# Altium project FIT_PM_Dual_Range_AFE.PrjPcb (part 1 of 8)
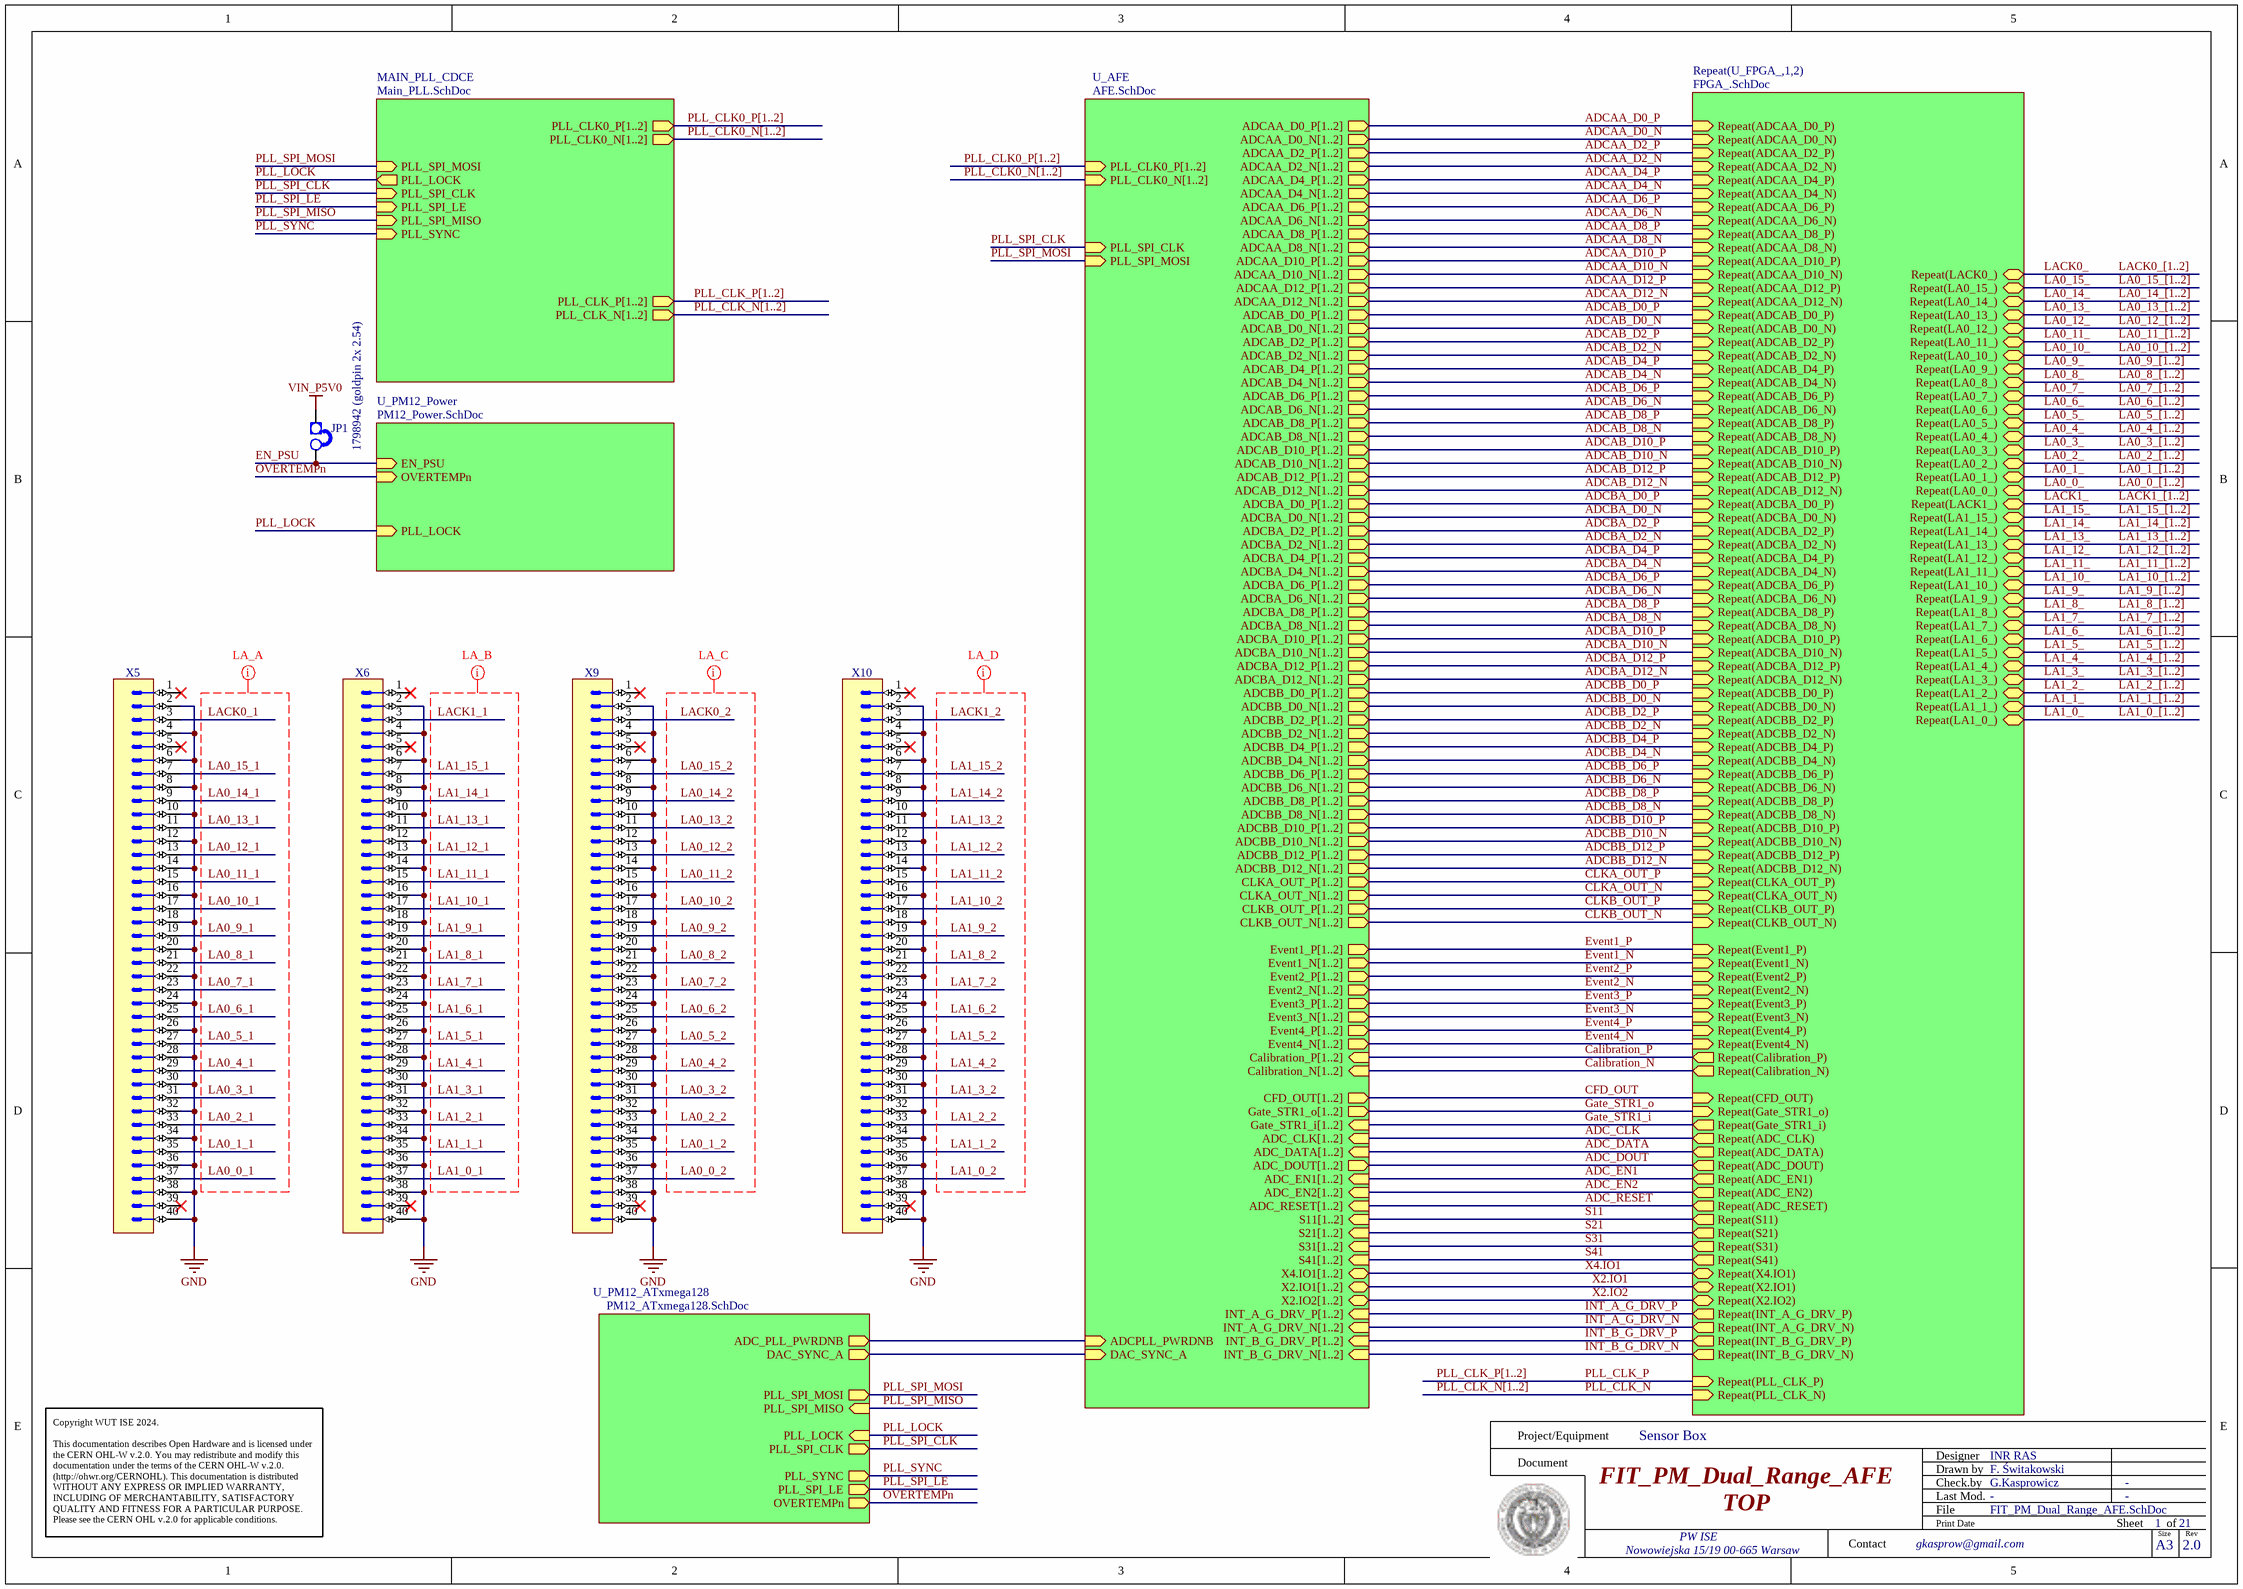
[diagram p0: FIT_PM_Dual_Range_AFE.SchDoc]
rev: 2.0
21 sheets, 892 parts. Net scope: hierarchical (ports join the sheet entries above them; power ports are global).
Board file: FIT_PM_Dual_Range_AFE.PcbDoc
Sheets:
  FIT_PM_Dual_Range_AFE.SchDoc
    MAIN_PLL_CDCE = Main_PLL.SchDoc
      U_ADCLK = ADCLK.SchDoc
    U_PM12_Power = PM12_Power.SchDoc
      U_PM12_LDO = PM12_LDO.SchDoc
      U_PM12_Supply_LED = PM12_Supply_LED.SchDoc
      U_PM12_P3V8 = PM12_P3V8.SchDoc
      U_PM12_P3V3 = PM12_P3V3.SchDoc
      U_PM12_N5V5 = PM12_N5V5.SchDoc
      U_PM12_P5V5 = PM12_P5V5.SchDoc
      U_PM12_P1V8 = PM12_P1V8.SchDoc
      U_SUP_VCCINT = SUP_VCCINT.SchDoc
    U_AFE = AFE.SchDoc
      INT1 = Integrators.SchDoc
      INT2 = Integrators.SchDoc
      QDC1 = DAC8554.SchDoc
      QDC2 = DAC8554.SchDoc
      ADC_PLL1 = ADC_PLL.SchDoc
      ADC_PLL2 = ADC_PLL.SchDoc
      Gate_Strobe1 = Gate_Strobe.SchDoc
      Gate_Strobe2 = Gate_Strobe.SchDoc
      U_ADCs1 = ADCs.SchDoc
      U_ADCs2 = ADCs.SchDoc
    U_PM12_ATxmega128 = PM12_ATxmega128.SchDoc
    U_FPGA_1 = FPGA_.SchDoc
      U_FPGA_MICS_SUP = FPGA_MICS_SUP.SchDoc
    U_FPGA_2 = FPGA_.SchDoc
      U_FPGA_MICS_SUP = FPGA_MICS_SUP.SchDoc

## Sheet FIT_PM_Dual_Range_AFE.SchDoc: FIT_PM_Dual_Range_AFE
size 420 x 297 mm; CheckedBy: G.Kasprowicz; Author: INR Moscow; CompanyName: WUT ISE; DrawnBy: F. Świtakowski; Organization: WUT ISE; Address1: PW ISE; Address2: Nowowiejska 15/19 00-665 Warsaw; Address3: gkasprow@gmail.com; DocumentNumber: 1; Revision: 2; SheetNumber: 1; SheetTotal: 21; ModifiedBy: -; CheckedDate: -; Title2: TOP; DivGrp: WUT ISE; Designer: INR RAS; ModifiedDate: -; ProjectName: Sensor Box

### Parts
JP1  1798942 (goldpin 2x 2.54)  [jump]
X5  (no value)  [CONNFLY_DS1013-40SSIB1-B-0]
X6  (no value)  [CONNFLY_DS1013-40SSIB1-B-0]
X9  (no value)  [CONNFLY_DS1013-40SSIB1-B-0]
X10  (no value)  [CONNFLY_DS1013-40SSIB1-B-0]

### Sub-sheets
MAIN_PLL_CDCE = Main_PLL.SchDoc: PLL_SPI_CLK (in), PLL_SYNC (in), PLL_LOCK (out), PLL_SPI_LE (in), PLL_SPI_MOSI (in), PLL_CLK0_P[1..2] (out), PLL_CLK0_N[1..2] (out), PLL_SPI_MISO (in), PLL_CLK_P[1..2] (out), PLL_CLK_N[1..2] (out)
Repeat(U_FPGA_,1,2) = FPGA_.SchDoc: Repeat(CLKB_OUT_P) (in), Repeat(CLKB_OUT_N) (in), Repeat(PLL_CLK_P) (in), Repeat(PLL_CLK_N) (in), Repeat(X4.IO1) (bidir), Repeat(X2.IO1) (bidir), Repeat(X2.IO2) (bidir), Repeat(ADCAA_D0_P) (in), Repeat(ADCAA_D0_N) (in), Repeat(ADCAA_D2_P) (in), Repeat(ADCAA_D2_N) (in), Repeat(ADCAA_D4_P) (in), Repeat(ADCAA_D4_N) (in), Repeat(ADCAA_D6_P) (in), Repeat(ADCAA_D6_N) (in), Repeat(ADCAA_D8_P) (in), Repeat(ADCAA_D8_N) (in), Repeat(ADCAA_D10_P) (in), Repeat(ADCAA_D10_N) (in), Repeat(ADCAA_D12_P) (in), Repeat(ADCAA_D12_N) (in), Repeat(CLKA_OUT_P) (in), Repeat(CLKA_OUT_N) (in), Repeat(ADCAB_D0_P) (in), Repeat(ADCAB_D0_N) (in), Repeat(ADCAB_D2_P) (in), Repeat(ADCAB_D2_N) (in), Repeat(ADCAB_D4_P) (in), Repeat(ADCAB_D4_N) (in), Repeat(ADCAB_D6_P) (in), Repeat(ADCAB_D6_N) (in), Repeat(ADCAB_D8_P) (in), Repeat(ADCAB_D8_N) (in), Repeat(ADCAB_D10_P) (in), Repeat(ADCAB_D10_N) (in), Repeat(ADCAB_D12_P) (in), Repeat(ADCAB_D12_N) (in), Repeat(ADCBA_D0_P) (in), Repeat(ADCBA_D0_N) (in), Repeat(ADCBA_D2_P) (in), Repeat(ADCBA_D2_N) (in), Repeat(ADCBA_D4_P) (in), Repeat(ADCBA_D4_N) (in), Repeat(ADCBA_D6_P) (in), Repeat(ADCBA_D6_N) (in), Repeat(ADCBA_D8_P) (in), Repeat(ADCBA_D8_N) (in), Repeat(ADCBA_D10_P) (in), Repeat(ADCBA_D10_N) (in), Repeat(ADCBA_D12_P) (in), Repeat(ADCBA_D12_N) (in), Repeat(ADCBB_D0_P) (in), Repeat(ADCBB_D0_N) (in), Repeat(ADCBB_D2_P) (in), Repeat(ADCBB_D2_N) (in), Repeat(ADCBB_D4_P) (in), Repeat(ADCBB_D4_N) (in), Repeat(ADCBB_D6_P) (in), Repeat(ADCBB_D6_N) (in), Repeat(ADCBB_D8_P) (in), Repeat(ADCBB_D8_N) (in), Repeat(ADCBB_D10_P) (in), Repeat(ADCBB_D10_N) (in), Repeat(ADCBB_D12_P) (in), Repeat(ADCBB_D12_N) (in), Repeat(Event1_P) (in), Repeat(Event1_N) (in), Repeat(CFD_OUT) (in), Repeat(Gate_STR1_o) (in), Repeat(Gate_STR1_i) (out), Repeat(ADC_CLK) (out), Repeat(ADC_DATA) (out), Repeat(ADC_DOUT) (out), Repeat(ADC_EN1) (out), Repeat(ADC_EN2) (out), Repeat(ADC_RESET) (out), Repeat(INT_A_G_DRV_P) (out), Repeat(INT_B_G_DRV_P) (out), Repeat(LACK0_) (bidir), Repeat(LA0_15_) (bidir), Repeat(LA0_14_) (bidir), Repeat(LA0_13_) (bidir), Repeat(LA0_12_) (bidir), Repeat(LA0_11_) (bidir), Repeat(LA0_10_) (bidir), Repeat(LA0_9_) (bidir), Repeat(LA0_8_) (bidir), Repeat(LA0_7_) (bidir), Repeat(LA0_6_) (bidir), Repeat(LA0_5_) (bidir), Repeat(LA0_4_) (bidir), Repeat(LA0_3_) (bidir), Repeat(LA0_2_) (bidir), Repeat(LA0_1_) (bidir), Repeat(LA0_0_) (bidir), Repeat(LACK1_) (bidir), Repeat(LA1_15_) (bidir), Repeat(LA1_14_) (bidir), Repeat(LA1_13_) (bidir), Repeat(LA1_12_) (bidir), Repeat(LA1_11_) (bidir), Repeat(LA1_10_) (bidir), Repeat(LA1_9_) (bidir), Repeat(LA1_8_) (bidir), Repeat(LA1_7_) (bidir), Repeat(LA1_6_) (bidir), Repeat(LA1_5_) (bidir), Repeat(LA1_4_) (bidir), Repeat(LA1_3_) (bidir), Repeat(LA1_2_) (bidir), Repeat(LA1_1_) (bidir), Repeat(LA1_0_) (bidir), Repeat(INT_A_G_DRV_N) (out), Repeat(INT_B_G_DRV_N) (out), Repeat(Event2_P) (in), Repeat(Event2_N) (in), Repeat(Event3_P) (in), Repeat(Event3_N) (in), Repeat(Event4_P) (in), Repeat(Event4_N) (in), Repeat(Calibration_P) (out), Repeat(Calibration_N) (out), Repeat(S11) (out), Repeat(S21) (out), Repeat(S31) (out), Repeat(S41) (out)
U_AFE = AFE.SchDoc: ADCPLL_PWRDNB (in), Event1_P[1..2] (out), PLL_CLK0_P[1..2] (in), PLL_CLK0_N[1..2] (in), ADCAA_D0_P[1..2] (out), ADCAA_D0_N[1..2] (out), ADCAA_D2_P[1..2] (out), ADCAA_D2_N[1..2] (out), ADCAA_D4_P[1..2] (out), ADCAA_D4_N[1..2] (out), ADCAA_D6_P[1..2] (out), ADCAA_D6_N[1..2] (out), ADCAA_D8_P[1..2] (out), ADCAA_D8_N[1..2] (out), ADCAA_D10_P[1..2] (out), ADCAA_D10_N[1..2] (out), ADCAA_D12_P[1..2] (out), ADCAA_D12_N[1..2] (out), ADCAB_D0_P[1..2] (out), ADCAB_D0_N[1..2] (out), ADCAB_D2_P[1..2] (out), ADCAB_D2_N[1..2] (out), ADCAB_D4_P[1..2] (out), ADCAB_D4_N[1..2] (out), ADCAB_D6_P[1..2] (out), ADCAB_D6_N[1..2] (out), ADCAB_D8_P[1..2] (out), ADCAB_D8_N[1..2] (out), ADCAB_D10_P[1..2] (out), ADCAB_D10_N[1..2] (out), ADCAB_D12_P[1..2] (out), ADCAB_D12_N[1..2] (out), ADCBA_D0_P[1..2] (out), ADCBA_D0_N[1..2] (out), ADCBA_D2_P[1..2] (out), ADCBA_D2_N[1..2] (out), ADCBA_D4_P[1..2] (out), ADCBA_D4_N[1..2] (out), ADCBA_D6_P[1..2] (out), ADCBA_D6_N[1..2] (out), ADCBA_D8_P[1..2] (out), ADCBA_D8_N[1..2] (out), ADCBA_D10_P[1..2] (out), ADCBA_D10_N[1..2] (out), ADCBA_D12_P[1..2] (out), ADCBA_D12_N[1..2] (out), ADCBB_D0_P[1..2] (out), ADCBB_D0_N[1..2] (out), ADCBB_D2_P[1..2] (out), ADCBB_D2_N[1..2] (out), ADCBB_D4_P[1..2] (out), ADCBB_D4_N[1..2] (out), ADCBB_D6_P[1..2] (out), ADCBB_D6_N[1..2] (out), ADCBB_D8_P[1..2] (out), ADCBB_D8_N[1..2] (out), ADCBB_D10_P[1..2] (out), ADCBB_D10_N[1..2] (out), ADCBB_D12_P[1..2] (out), ADCBB_D12_N[1..2] (out), CLKA_OUT_P[1..2] (out), CLKA_OUT_N[1..2] (out), CLKB_OUT_P[1..2] (out), CLKB_OUT_N[1..2] (out), DAC_SYNC_A (in), Event1_N[1..2] (out), CFD_OUT[1..2] (out), Gate_STR1_o[1..2] (out), Gate_STR1_i[1..2] (in), ADC_CLK[1..2] (in), ADC_DATA[1..2] (in), ADC_DOUT[1..2] (out), ADC_EN1[1..2] (in), ADC_EN2[1..2] (in), ADC_RESET[1..2] (in), PLL_SPI_CLK (in), PLL_SPI_MOSI (in), INT_A_G_DRV_P[1..2] (in), INT_B_G_DRV_P[1..2] (in), X4.IO1[1..2] (bidir), X2.IO1[1..2] (bidir), X2.IO2[1..2] (bidir), INT_A_G_DRV_N[1..2] (in), INT_B_G_DRV_N[1..2] (in), Event2_P[1..2] (out), Event2_N[1..2] (out), Event3_P[1..2] (out), Event3_N[1..2] (out), Event4_P[1..2] (out), Event4_N[1..2] (out), Calibration_P[1..2] (in), Calibration_N[1..2] (in), S11[1..2] (in), S21[1..2] (in), S31[1..2] (in), S41[1..2] (in)
U_PM12_ATxmega128 = PM12_ATxmega128.SchDoc: ADC_PLL_PWRDNB (out), PLL_SPI_MOSI (out), DAC_SYNC_A (out), PLL_SPI_CLK (out), PLL_SPI_MISO (in), PLL_SYNC (out), PLL_LOCK (in), PLL_SPI_LE (out), OVERTEMPn (out)
U_PM12_Power = PM12_Power.SchDoc: EN_PSU (in), OVERTEMPn (in), PLL_LOCK (in)

### Nets
GND: X5.2 X5.4 X5.6 X5.8 X5.10 X5.12 X5.14 X5.16 X5.18 X5.20 X5.22 X5.24 X5.26 X5.28 X5.30 X5.32 X5.34 X5.36 X5.38 X5.40 X6.2 X6.4 X6.6 X6.8 X6.10 X6.12 X6.14 X6.16 X6.18 X6.20 X6.22 X6.24 X6.26 X6.28 X6.30 X6.32 X6.34 X6.36 X6.38 X6.40 X9.2 X9.4 X9.6 X9.8 X9.10 X9.12 X9.14 X9.16 X9.18 X9.20 X9.22 X9.24 X9.26 X9.28 X9.30 X9.32 X9.34 X9.36 X9.38 X9.40 X10.2 X10.4 X10.6 X10.8 X10.10 X10.12 X10.14 X10.16 X10.18 X10.20 X10.22 X10.24 X10.26 X10.28 X10.30 X10.32 X10.34 X10.36 X10.38 X10.40
VIN_P5V0: JP1.1(E1)
ADC_CLK: sheet Repeat(U_FPGA_,1,2)/Repeat(ADC_CLK)
ADC_DATA: sheet Repeat(U_FPGA_,1,2)/Repeat(ADC_DATA)
ADC_DOUT: sheet Repeat(U_FPGA_,1,2)/Repeat(ADC_DOUT)
ADC_EN1: sheet Repeat(U_FPGA_,1,2)/Repeat(ADC_EN1)
ADC_EN2: sheet Repeat(U_FPGA_,1,2)/Repeat(ADC_EN2)
ADC_PLL_PWRDNB: sheet U_AFE/ADCPLL_PWRDNB, sheet U_PM12_ATxmega128/ADC_PLL_PWRDNB
ADC_RESET: sheet Repeat(U_FPGA_,1,2)/Repeat(ADC_RESET)
ADCAA_D0_N: sheet Repeat(U_FPGA_,1,2)/Repeat(ADCAA_D0_N)
ADCAA_D0_P: sheet Repeat(U_FPGA_,1,2)/Repeat(ADCAA_D0_P)
ADCAA_D2_N: sheet Repeat(U_FPGA_,1,2)/Repeat(ADCAA_D2_N)
ADCAA_D2_P: sheet Repeat(U_FPGA_,1,2)/Repeat(ADCAA_D2_P)
ADCAA_D4_N: sheet Repeat(U_FPGA_,1,2)/Repeat(ADCAA_D4_N)
ADCAA_D4_P: sheet Repeat(U_FPGA_,1,2)/Repeat(ADCAA_D4_P)
ADCAA_D6_N: sheet Repeat(U_FPGA_,1,2)/Repeat(ADCAA_D6_N)
ADCAA_D6_P: sheet Repeat(U_FPGA_,1,2)/Repeat(ADCAA_D6_P)
ADCAA_D8_N: sheet Repeat(U_FPGA_,1,2)/Repeat(ADCAA_D8_N)
ADCAA_D8_P: sheet Repeat(U_FPGA_,1,2)/Repeat(ADCAA_D8_P)
ADCAA_D10_N: sheet Repeat(U_FPGA_,1,2)/Repeat(ADCAA_D10_N)
ADCAA_D10_P: sheet Repeat(U_FPGA_,1,2)/Repeat(ADCAA_D10_P)
ADCAA_D12_N: sheet Repeat(U_FPGA_,1,2)/Repeat(ADCAA_D12_N)
ADCAA_D12_P: sheet Repeat(U_FPGA_,1,2)/Repeat(ADCAA_D12_P)
ADCAB_D0_N: sheet Repeat(U_FPGA_,1,2)/Repeat(ADCAB_D0_N)
ADCAB_D0_P: sheet Repeat(U_FPGA_,1,2)/Repeat(ADCAB_D0_P)
ADCAB_D2_N: sheet Repeat(U_FPGA_,1,2)/Repeat(ADCAB_D2_N)
ADCAB_D2_P: sheet Repeat(U_FPGA_,1,2)/Repeat(ADCAB_D2_P)
ADCAB_D4_N: sheet Repeat(U_FPGA_,1,2)/Repeat(ADCAB_D4_N)
ADCAB_D4_P: sheet Repeat(U_FPGA_,1,2)/Repeat(ADCAB_D4_P)
ADCAB_D6_N: sheet Repeat(U_FPGA_,1,2)/Repeat(ADCAB_D6_N)
ADCAB_D6_P: sheet Repeat(U_FPGA_,1,2)/Repeat(ADCAB_D6_P)
ADCAB_D8_N: sheet Repeat(U_FPGA_,1,2)/Repeat(ADCAB_D8_N)
ADCAB_D8_P: sheet Repeat(U_FPGA_,1,2)/Repeat(ADCAB_D8_P)
ADCAB_D10_N: sheet Repeat(U_FPGA_,1,2)/Repeat(ADCAB_D10_N)
ADCAB_D10_P: sheet Repeat(U_FPGA_,1,2)/Repeat(ADCAB_D10_P)
ADCAB_D12_N: sheet Repeat(U_FPGA_,1,2)/Repeat(ADCAB_D12_N)
ADCAB_D12_P: sheet Repeat(U_FPGA_,1,2)/Repeat(ADCAB_D12_P)
ADCBA_D0_N: sheet Repeat(U_FPGA_,1,2)/Repeat(ADCBA_D0_N)
ADCBA_D0_P: sheet Repeat(U_FPGA_,1,2)/Repeat(ADCBA_D0_P)
ADCBA_D2_N: sheet Repeat(U_FPGA_,1,2)/Repeat(ADCBA_D2_N)
ADCBA_D2_P: sheet Repeat(U_FPGA_,1,2)/Repeat(ADCBA_D2_P)
ADCBA_D4_N: sheet Repeat(U_FPGA_,1,2)/Repeat(ADCBA_D4_N)
ADCBA_D4_P: sheet Repeat(U_FPGA_,1,2)/Repeat(ADCBA_D4_P)
ADCBA_D6_N: sheet Repeat(U_FPGA_,1,2)/Repeat(ADCBA_D6_N)
ADCBA_D6_P: sheet Repeat(U_FPGA_,1,2)/Repeat(ADCBA_D6_P)
ADCBA_D8_N: sheet Repeat(U_FPGA_,1,2)/Repeat(ADCBA_D8_N)
ADCBA_D8_P: sheet Repeat(U_FPGA_,1,2)/Repeat(ADCBA_D8_P)
ADCBA_D10_N: sheet Repeat(U_FPGA_,1,2)/Repeat(ADCBA_D10_N)
ADCBA_D10_P: sheet Repeat(U_FPGA_,1,2)/Repeat(ADCBA_D10_P)
ADCBA_D12_N: sheet Repeat(U_FPGA_,1,2)/Repeat(ADCBA_D12_N)
ADCBA_D12_P: sheet Repeat(U_FPGA_,1,2)/Repeat(ADCBA_D12_P)
ADCBB_D0_N: sheet Repeat(U_FPGA_,1,2)/Repeat(ADCBB_D0_N)
ADCBB_D0_P: sheet Repeat(U_FPGA_,1,2)/Repeat(ADCBB_D0_P)
ADCBB_D2_N: sheet Repeat(U_FPGA_,1,2)/Repeat(ADCBB_D2_N)
ADCBB_D2_P: sheet Repeat(U_FPGA_,1,2)/Repeat(ADCBB_D2_P)
ADCBB_D4_N: sheet Repeat(U_FPGA_,1,2)/Repeat(ADCBB_D4_N)
ADCBB_D4_P: sheet Repeat(U_FPGA_,1,2)/Repeat(ADCBB_D4_P)
ADCBB_D6_N: sheet Repeat(U_FPGA_,1,2)/Repeat(ADCBB_D6_N)
ADCBB_D6_P: sheet Repeat(U_FPGA_,1,2)/Repeat(ADCBB_D6_P)
ADCBB_D8_N: sheet Repeat(U_FPGA_,1,2)/Repeat(ADCBB_D8_N)
ADCBB_D8_P: sheet Repeat(U_FPGA_,1,2)/Repeat(ADCBB_D8_P)
ADCBB_D10_N: sheet Repeat(U_FPGA_,1,2)/Repeat(ADCBB_D10_N)
ADCBB_D10_P: sheet Repeat(U_FPGA_,1,2)/Repeat(ADCBB_D10_P)
ADCBB_D12_N: sheet Repeat(U_FPGA_,1,2)/Repeat(ADCBB_D12_N)
ADCBB_D12_P: sheet Repeat(U_FPGA_,1,2)/Repeat(ADCBB_D12_P)
Calibration_N: sheet Repeat(U_FPGA_,1,2)/Repeat(Calibration_N)
Calibration_P: sheet Repeat(U_FPGA_,1,2)/Repeat(Calibration_P)
CFD_OUT: sheet Repeat(U_FPGA_,1,2)/Repeat(CFD_OUT)
CLKA_OUT_N: sheet Repeat(U_FPGA_,1,2)/Repeat(CLKA_OUT_N)
CLKA_OUT_P: sheet Repeat(U_FPGA_,1,2)/Repeat(CLKA_OUT_P)
CLKB_OUT_N: sheet Repeat(U_FPGA_,1,2)/Repeat(CLKB_OUT_N)
CLKB_OUT_P: sheet Repeat(U_FPGA_,1,2)/Repeat(CLKB_OUT_P)
DAC_SYNC: sheet U_AFE/DAC_SYNC_A, sheet U_PM12_ATxmega128/DAC_SYNC_A
EN_PSU: JP1.2(E2) ; sheet U_PM12_Power/EN_PSU
Event1_N: sheet Repeat(U_FPGA_,1,2)/Repeat(Event1_N)
Event1_P: sheet Repeat(U_FPGA_,1,2)/Repeat(Event1_P)
Event2_N: sheet Repeat(U_FPGA_,1,2)/Repeat(Event2_N)
Event2_P: sheet Repeat(U_FPGA_,1,2)/Repeat(Event2_P)
Event3_N: sheet Repeat(U_FPGA_,1,2)/Repeat(Event3_N)
Event3_P: sheet Repeat(U_FPGA_,1,2)/Repeat(Event3_P)
Event4_N: sheet Repeat(U_FPGA_,1,2)/Repeat(Event4_N)
Event4_P: sheet Repeat(U_FPGA_,1,2)/Repeat(Event4_P)
Gate_STR1_i: sheet Repeat(U_FPGA_,1,2)/Repeat(Gate_STR1_i)
Gate_STR1_o: sheet Repeat(U_FPGA_,1,2)/Repeat(Gate_STR1_o)
INT_A_G_DRV_N: sheet Repeat(U_FPGA_,1,2)/Repeat(INT_A_G_DRV_N)
INT_A_G_DRV_P: sheet Repeat(U_FPGA_,1,2)/Repeat(INT_A_G_DRV_P)
INT_B_G_DRV_N: sheet Repeat(U_FPGA_,1,2)/Repeat(INT_B_G_DRV_N)
INT_B_G_DRV_P: sheet Repeat(U_FPGA_,1,2)/Repeat(INT_B_G_DRV_P)
LA0_0_: sheet Repeat(U_FPGA_,1,2)/Repeat(LA0_0_)
LA0_0_1: X5.37  [project net LA0_0_]
LA0_0_2: X9.37  [project net LA0_0_]
LA0_1_: sheet Repeat(U_FPGA_,1,2)/Repeat(LA0_1_)
LA0_1_1: X5.35  [project net LA0_1_]
LA0_1_2: X9.35  [project net LA0_1_]
LA0_2_: sheet Repeat(U_FPGA_,1,2)/Repeat(LA0_2_)
LA0_2_1: X5.33  [project net LA0_2_]
LA0_2_2: X9.33  [project net LA0_2_]
LA0_3_: sheet Repeat(U_FPGA_,1,2)/Repeat(LA0_3_)
LA0_3_1: X5.31  [project net LA0_3_]
LA0_3_2: X9.31  [project net LA0_3_]
LA0_4_: sheet Repeat(U_FPGA_,1,2)/Repeat(LA0_4_)
LA0_4_1: X5.29  [project net LA0_4_]
LA0_4_2: X9.29  [project net LA0_4_]
LA0_5_: sheet Repeat(U_FPGA_,1,2)/Repeat(LA0_5_)
LA0_5_1: X5.27  [project net LA0_5_]
LA0_5_2: X9.27  [project net LA0_5_]
LA0_6_: sheet Repeat(U_FPGA_,1,2)/Repeat(LA0_6_)
LA0_6_1: X5.25  [project net LA0_6_]
LA0_6_2: X9.25  [project net LA0_6_]
LA0_7_: sheet Repeat(U_FPGA_,1,2)/Repeat(LA0_7_)
LA0_7_1: X5.23  [project net LA0_7_]
LA0_7_2: X9.23  [project net LA0_7_]
LA0_8_: sheet Repeat(U_FPGA_,1,2)/Repeat(LA0_8_)
LA0_8_1: X5.21  [project net LA0_8_]
LA0_8_2: X9.21  [project net LA0_8_]
LA0_9_: sheet Repeat(U_FPGA_,1,2)/Repeat(LA0_9_)
LA0_9_1: X5.19  [project net LA0_9_]
LA0_9_2: X9.19  [project net LA0_9_]
LA0_10_: sheet Repeat(U_FPGA_,1,2)/Repeat(LA0_10_)
LA0_10_1: X5.17  [project net LA0_10_]
LA0_10_2: X9.17  [project net LA0_10_]
LA0_11_: sheet Repeat(U_FPGA_,1,2)/Repeat(LA0_11_)
LA0_11_1: X5.15  [project net LA0_11_]
LA0_11_2: X9.15  [project net LA0_11_]
LA0_12_: sheet Repeat(U_FPGA_,1,2)/Repeat(LA0_12_)
LA0_12_1: X5.13  [project net LA0_12_]
LA0_12_2: X9.13  [project net LA0_12_]
LA0_13_: sheet Repeat(U_FPGA_,1,2)/Repeat(LA0_13_)
LA0_13_1: X5.11  [project net LA0_13_]
LA0_13_2: X9.11  [project net LA0_13_]
LA0_14_: sheet Repeat(U_FPGA_,1,2)/Repeat(LA0_14_)
LA0_14_1: X5.9  [project net LA0_14_]
LA0_14_2: X9.9  [project net LA0_14_]
LA0_15_: sheet Repeat(U_FPGA_,1,2)/Repeat(LA0_15_)
LA0_15_1: X5.7  [project net LA0_15_]
LA0_15_2: X9.7  [project net LA0_15_]
LA1_0_: sheet Repeat(U_FPGA_,1,2)/Repeat(LA1_0_)
LA1_0_1: X6.37  [project net LA1_0_]
LA1_0_2: X10.37  [project net LA1_0_]
LA1_1_: sheet Repeat(U_FPGA_,1,2)/Repeat(LA1_1_)
LA1_1_1: X6.35  [project net LA1_1_]
LA1_1_2: X10.35  [project net LA1_1_]
LA1_2_: sheet Repeat(U_FPGA_,1,2)/Repeat(LA1_2_)
LA1_2_1: X6.33  [project net LA1_2_]
LA1_2_2: X10.33  [project net LA1_2_]
LA1_3_: sheet Repeat(U_FPGA_,1,2)/Repeat(LA1_3_)
LA1_3_1: X6.31  [project net LA1_3_]
LA1_3_2: X10.31  [project net LA1_3_]
LA1_4_: sheet Repeat(U_FPGA_,1,2)/Repeat(LA1_4_)
LA1_4_1: X6.29  [project net LA1_4_]
LA1_4_2: X10.29  [project net LA1_4_]
LA1_5_: sheet Repeat(U_FPGA_,1,2)/Repeat(LA1_5_)
LA1_5_1: X6.27  [project net LA1_5_]
LA1_5_2: X10.27  [project net LA1_5_]
LA1_6_: sheet Repeat(U_FPGA_,1,2)/Repeat(LA1_6_)
LA1_6_1: X6.25  [project net LA1_6_]
LA1_6_2: X10.25  [project net LA1_6_]
LA1_7_: sheet Repeat(U_FPGA_,1,2)/Repeat(LA1_7_)
LA1_7_1: X6.23  [project net LA1_7_]
LA1_7_2: X10.23  [project net LA1_7_]
LA1_8_: sheet Repeat(U_FPGA_,1,2)/Repeat(LA1_8_)
LA1_8_1: X6.21  [project net LA1_8_]
LA1_8_2: X10.21  [project net LA1_8_]
LA1_9_: sheet Repeat(U_FPGA_,1,2)/Repeat(LA1_9_)
LA1_9_1: X6.19  [project net LA1_9_]
LA1_9_2: X10.19  [project net LA1_9_]
LA1_10_: sheet Repeat(U_FPGA_,1,2)/Repeat(LA1_10_)
LA1_10_1: X6.17  [project net LA1_10_]
LA1_10_2: X10.17  [project net LA1_10_]
LA1_11_: sheet Repeat(U_FPGA_,1,2)/Repeat(LA1_11_)
LA1_11_1: X6.15  [project net LA1_11_]
LA1_11_2: X10.15  [project net LA1_11_]
LA1_12_: sheet Repeat(U_FPGA_,1,2)/Repeat(LA1_12_)
LA1_12_1: X6.13  [project net LA1_12_]
LA1_12_2: X10.13  [project net LA1_12_]
LA1_13_: sheet Repeat(U_FPGA_,1,2)/Repeat(LA1_13_)
LA1_13_1: X6.11  [project net LA1_13_]
LA1_13_2: X10.11  [project net LA1_13_]
LA1_14_: sheet Repeat(U_FPGA_,1,2)/Repeat(LA1_14_)
LA1_14_1: X6.9  [project net LA1_14_]
LA1_14_2: X10.9  [project net LA1_14_]
LA1_15_: sheet Repeat(U_FPGA_,1,2)/Repeat(LA1_15_)
LA1_15_1: X6.7  [project net LA1_15_]
LA1_15_2: X10.7  [project net LA1_15_]
LACK0_: sheet Repeat(U_FPGA_,1,2)/Repeat(LACK0_)
LACK0_1: X5.3  [project net LACK0_]
LACK0_2: X9.3  [project net LACK0_]
LACK1_: sheet Repeat(U_FPGA_,1,2)/Repeat(LACK1_)
LACK1_1: X6.3  [project net LACK1_]
LACK1_2: X10.3  [project net LACK1_]
OVERTEMPn: sheet U_PM12_Power/OVERTEMPn, sheet U_PM12_ATxmega128/OVERTEMPn
PLL_CLK_N: sheet Repeat(U_FPGA_,1,2)/Repeat(PLL_CLK_N)
PLL_CLK_P: sheet Repeat(U_FPGA_,1,2)/Repeat(PLL_CLK_P)
PLL_LOCK: sheet MAIN_PLL_CDCE/PLL_LOCK, sheet U_PM12_Power/PLL_LOCK, sheet U_PM12_ATxmega128/PLL_LOCK
PLL_SPI_CLK: sheet MAIN_PLL_CDCE/PLL_SPI_CLK, sheet U_AFE/PLL_SPI_CLK, sheet U_PM12_ATxmega128/PLL_SPI_CLK
PLL_SPI_LE: sheet MAIN_PLL_CDCE/PLL_SPI_LE, sheet U_PM12_ATxmega128/PLL_SPI_LE
PLL_SPI_MISO: sheet MAIN_PLL_CDCE/PLL_SPI_MISO, sheet U_PM12_ATxmega128/PLL_SPI_MISO
PLL_SPI_MOSI: sheet MAIN_PLL_CDCE/PLL_SPI_MOSI, sheet U_AFE/PLL_SPI_MOSI, sheet U_PM12_ATxmega128/PLL_SPI_MOSI
PLL_SYNC: sheet MAIN_PLL_CDCE/PLL_SYNC, sheet U_PM12_ATxmega128/PLL_SYNC
S11: sheet Repeat(U_FPGA_,1,2)/Repeat(S11)
S21: sheet Repeat(U_FPGA_,1,2)/Repeat(S21)
S31: sheet Repeat(U_FPGA_,1,2)/Repeat(S31)
S41: sheet Repeat(U_FPGA_,1,2)/Repeat(S41)
X2.IO1: sheet Repeat(U_FPGA_,1,2)/Repeat(X2.IO1)
X2.IO2: sheet Repeat(U_FPGA_,1,2)/Repeat(X2.IO2)
X4.IO1: sheet Repeat(U_FPGA_,1,2)/Repeat(X4.IO1)

Not connected (* = marked no-connect by the designer): X5 1* 5* 39*; X6 1* 5* 39*; X9 1* 5* 39*; X10 1* 5* 39*

### Buses and harness runs
bus LA0_0_[1..2]
bus LA0_1_[1..2]
bus LA0_2_[1..2]
bus LA0_3_[1..2]
bus LA0_4_[1..2]
bus LA0_5_[1..2]
bus LA0_6_[1..2]
bus LA0_7_[1..2]
bus LA0_8_[1..2]
bus LA0_9_[1..2]
bus LA0_10_[1..2]
bus LA0_11_[1..2]
bus LA0_12_[1..2]
bus LA0_13_[1..2]
bus LA0_14_[1..2]
bus LA0_15_[1..2]
bus LA1_0_[1..2]
bus LA1_1_[1..2]
bus LA1_2_[1..2]
bus LA1_3_[1..2]
bus LA1_4_[1..2]
bus LA1_5_[1..2]
bus LA1_6_[1..2]
bus LA1_7_[1..2]
bus LA1_8_[1..2]
bus LA1_9_[1..2]
bus LA1_10_[1..2]
bus LA1_11_[1..2]
bus LA1_12_[1..2]
bus LA1_13_[1..2]
bus LA1_14_[1..2]
bus LA1_15_[1..2]
bus LACK0_[1..2]
bus LACK1_[1..2]
bus PLL_CLK0_N[1..2] = sheet MAIN_PLL_CDCE/PLL_CLK0_N[1..2]
bus PLL_CLK0_N[1..2] = sheet U_AFE/PLL_CLK0_N[1..2]
bus PLL_CLK0_P[1..2] = sheet MAIN_PLL_CDCE/PLL_CLK0_P[1..2]
bus PLL_CLK0_P[1..2] = sheet U_AFE/PLL_CLK0_P[1..2]
bus PLL_CLK_N[1..2]
bus PLL_CLK_N[1..2] = sheet MAIN_PLL_CDCE/PLL_CLK_N[1..2]
bus PLL_CLK_P[1..2]
bus PLL_CLK_P[1..2] = sheet MAIN_PLL_CDCE/PLL_CLK_P[1..2]

### Layout directives
net class LA_A: LA0_0_1, LA0_1_1, LA0_2_1, LA0_3_1, LA0_4_1, LA0_5_1, LA0_6_1, LA0_7_1, LA0_8_1, LA0_9_1, LA0_10_1, LA0_11_1, LA0_12_1, LA0_13_1, LA0_14_1, LA0_15_1, LACK0_1
net class LA_B: LA1_0_1, LA1_1_1, LA1_2_1, LA1_3_1, LA1_4_1, LA1_5_1, LA1_6_1, LA1_7_1, LA1_8_1, LA1_9_1, LA1_10_1, LA1_11_1, LA1_12_1, LA1_13_1, LA1_14_1, LA1_15_1, LACK1_1
net class LA_C: LA0_0_2, LA0_1_2, LA0_2_2, LA0_3_2, LA0_4_2, LA0_5_2, LA0_6_2, LA0_7_2, LA0_8_2, LA0_9_2, LA0_10_2, LA0_11_2, LA0_12_2, LA0_13_2, LA0_14_2, LA0_15_2, LACK0_2
net class LA_D: LA1_0_2, LA1_1_2, LA1_2_2, LA1_3_2, LA1_4_2, LA1_5_2, LA1_6_2, LA1_7_2, LA1_8_2, LA1_9_2, LA1_10_2, LA1_11_2, LA1_12_2, LA1_13_2, LA1_14_2, LA1_15_2, LACK1_2

### Notes on the sheet
- Project/Equipment
- Document
- Designer
- Drawn by
- Check.by
- Copyright WUT ISE 2024.
  This documentation describes Open Hardware and is licensed under the CERN OHL-W v.2.0. You may redistribute and modify this documentation under the terms of the CERN OHL-W v.2.0. (http://ohwr.org/CERNOHL). This documentation is distributed WITHOUT ANY EXPRESS OR IMPLIED WARRANTY, INCLUDING OF MERCHANTABILITY, SATISFACTORY QUALITY AND FITNESS FOR A PARTICULAR PURPOSE. Please see the CERN OHL v.2.0 for applicable conditions.
- Contact
- File
- Last Mod.
- Print Date
- Sheet
- Size
- A3
- of
- Rev

### Library data of the parts
JP1 = JUMPER: Manufacturer Part Number: 68001-102HLF; Supplier 1: Farnell; Supplier Part Number 1: 1798942
X5 X6 X9 X10 = CONNFLY_DS1013-40SSIB1-B-0: Connector 40 Male; Part Description: 40 Contacts, 2.54mm Box Header V/T,R/A & SMT Type; PressFit: No; Part Number: CONNFLY_DS1013-40SSIB1-B-0; Component Kind: Standard; Component Type: Standard; Pin Count: 40; Mounted: Yes; Socket: No; SMD: No; Sense: No; Status: None; Manufacturer: CONNFLY; Manufacturer Part Number: DS1013-40SSIB1-B-0; ComponentHeight: 9.1mm; HelpURL: \\cern.ch\dfs\Applications\Altium\Datasheets\CONNFLY_DS1013.pdf; Author: CERN DEM HF; CreateDate: 30.05.2024; LatestRevisionDate: 30.05.2024

## Sheet Main_PLL.SchDoc: FIT_PM12 board
size 420 x 297 mm; CheckedBy: G.Kasprowicz; Author: INR Moscow; CompanyName: WUT ISE; DrawnBy: M.Podgórski; Organization: WUT ISE; Address1: PW ISE; Address2: Nowowiejska 15/19 00-665 Warsaw; Address3: gkasprow@gmail.com; DocumentNumber: 9; Revision: 2; SheetNumber: 2; SheetTotal: 21; ModifiedBy: -; CheckedDate: -; Title2: Clocking; DivGrp: WUT ISE; Designer: INR RAS; ModifiedDate: -; ProjectName: Sensor Box
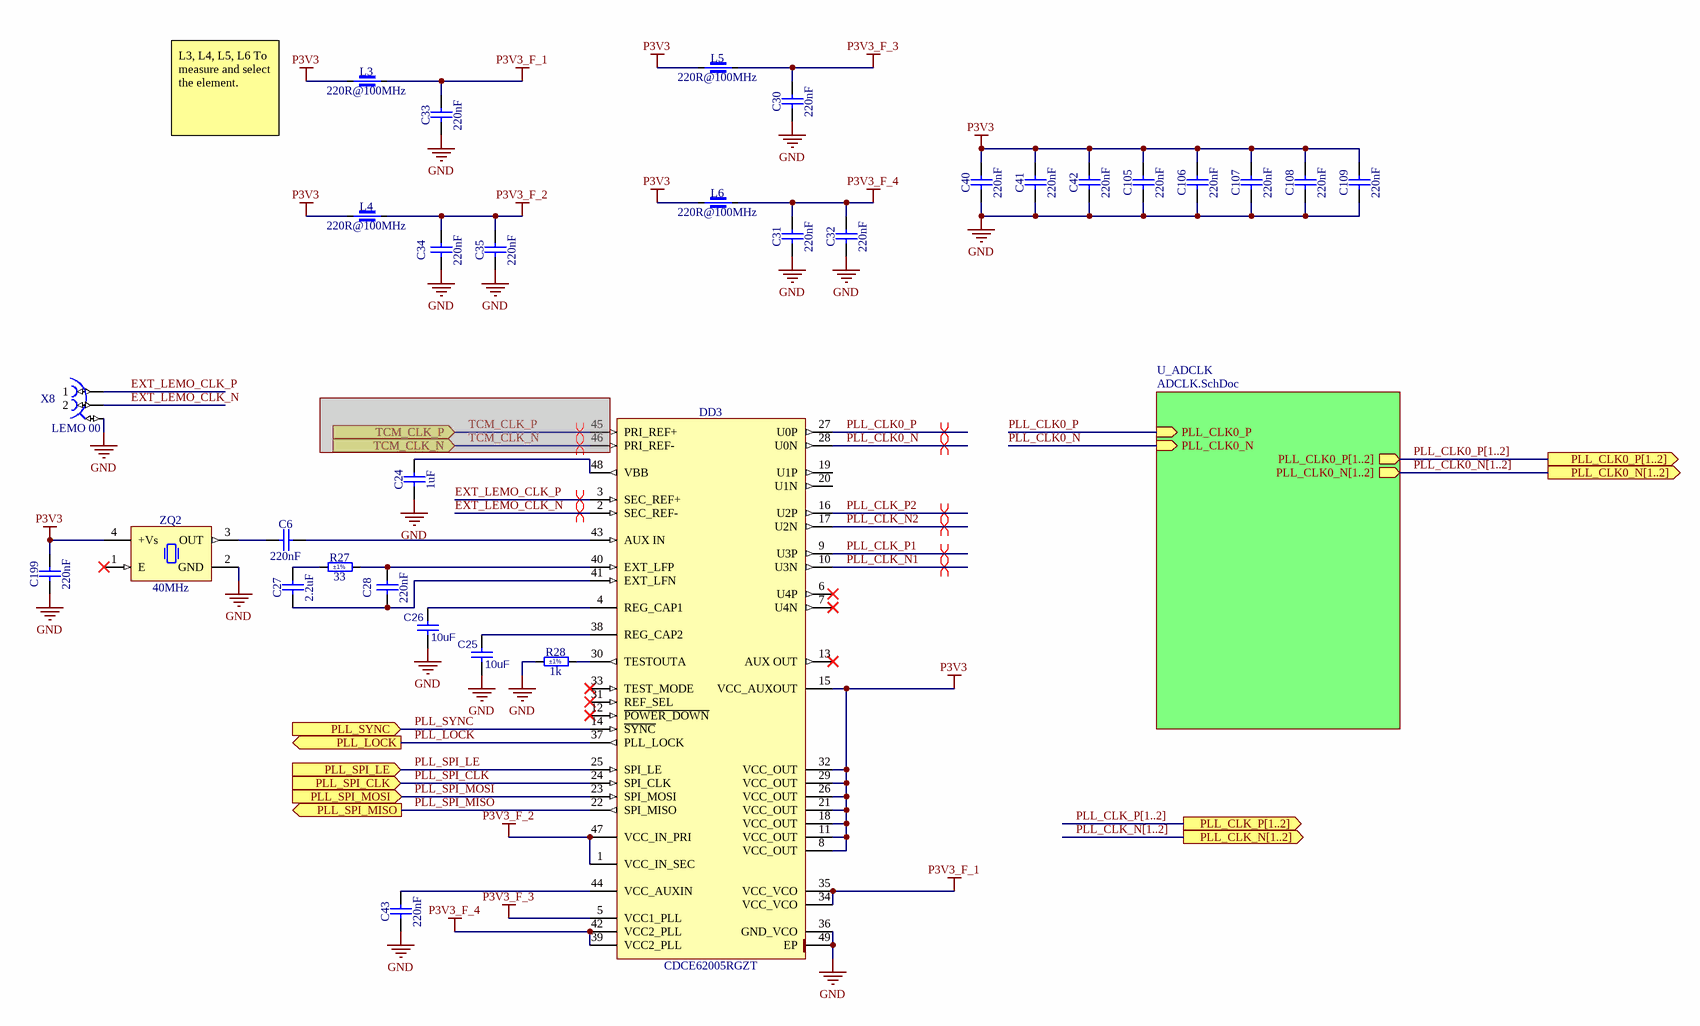
[diagram p1: Main_PLL.SchDoc]

### Parts
C6  220nF  [CAPC1005X55N]
C24  1uF  [CAPC2012X140N]
C25  10uF  [CAPC1005X70N]
C26  10uF  [CAPC1005X70N]
C27  2.2uF  [CAPC2012X140N]
C28  220nF  [CAPC2012X135N]
C30  220nF  [CAPC2012X135N]
C31  220nF  [CAPC2012X135N]
C32  220nF  [CAPC2012X135N]
C33  220nF  [CAPC2012X135N]
C34  220nF  [CAPC2012X135N]
C35  220nF  [CAPC2012X135N]
C40  220nF  [CAPC1005X55N]
C41  220nF  [CAPC1005X55N]
C42  220nF  [CAPC1005X55N]
C43  220nF  [CAPC2012X135N]
C105  220nF  [CAPC1005X55N]
C106  220nF  [CAPC1005X55N]
C107  220nF  [CAPC1005X55N]
C108  220nF  [CAPC1005X55N]
C109  220nF  [CAPC1005X55N]
C199  220nF  [CAPC2012X135N]
DD3  CDCE62005RGZT  [QFN50P700X700X100-49N-S570]
L3  220R@100MHz  [INDC2012X105N]
L4  220R@100MHz  [INDC2012X105N]
L5  220R@100MHz  [INDC2012X105N]
L6  220R@100MHz  [INDC2012X105N]
R27  33  Tolerance: ±1%  [RESC1005X40N]
R28  1k  Tolerance: ±1%  [RESC1005X40N]
X8  LEMO 00  [LEMO_EPG.00.302.NLN]
ZQ2  40MHz  [OSC_IQD_CFPS-73]

### Sub-sheets
U_ADCLK = ADCLK.SchDoc: PLL_CLK0_P[1..2] (out), PLL_CLK0_N[1..2] (out), PLL_CLK0_P (in), PLL_CLK0_N (in)

### Ports
PLL_CLK0_N[1..2] (out), PLL_CLK0_P[1..2] (out), PLL_CLK_N[1..2] (out), PLL_CLK_P[1..2] (out), PLL_LOCK (out), PLL_SPI_CLK (in), PLL_SPI_LE (in), PLL_SPI_MISO (out), PLL_SPI_MOSI (in), PLL_SYNC (in), TCM_CLK_N (in), TCM_CLK_P (in)

### Nets
GND: C24.1 C25.1 C26.1 C30.1 C31.1 C32.1 C33.1 C34.1 C35.1 C40.1 C41.1 C42.1 C43.1 C105.1 C106.1 C107.1 C108.1 C109.1 C199.1 DD3.36(GND_VCO) DD3.49(EP) R28.1 X8.3 ZQ2.2(GND)
P3V3: C40.2 C41.2 C42.2 C105.2 C106.2 C107.2 C108.2 C109.2 C199.2 DD3.8(VCC_OUT) DD3.11(VCC_OUT) DD3.15(VCC_AUXOUT) DD3.18(VCC_OUT) DD3.21(VCC_OUT) DD3.26(VCC_OUT) DD3.29(VCC_OUT) DD3.32(VCC_OUT) L3.1 L4.1 L5.1 L6.1 ZQ2.4(+Vs)
P3V3_F_1: C33.2 DD3.34(VCC_VCO) DD3.35(VCC_VCO) L3.2
P3V3_F_2: C34.2 C35.2 DD3.1(VCC_IN_SEC) DD3.47(VCC_IN_PRI) L4.2
P3V3_F_3: C30.2 DD3.5(VCC1_PLL) L5.2
P3V3_F_4: C31.2 C32.2 DD3.39(VCC2_PLL) DD3.42(VCC2_PLL) L6.2
EXT_LEMO_CLK_N: DD3.2(SEC_REF-) X8.2
EXT_LEMO_CLK_P: DD3.3(SEC_REF+) X8.1
PLL_CLK0_N: DD3.28(U0N) ; sheet U_ADCLK/PLL_CLK0_N
PLL_CLK0_P: DD3.27(U0P) ; sheet U_ADCLK/PLL_CLK0_P
PLL_CLK_N1: DD3.10(U3N)  [project net PLL_CLK_N]
PLL_CLK_N2: DD3.17(U2N)  [project net PLL_CLK_N]
PLL_CLK_P1: DD3.9(U3P)  [project net PLL_CLK_P]
PLL_CLK_P2: DD3.16(U2P)  [project net PLL_CLK_P]
PLL_LOCK: DD3.37(PLL_LOCK) ; port PLL_LOCK
PLL_SPI_CLK: DD3.24(SPI_CLK) ; port PLL_SPI_CLK
PLL_SPI_LE: DD3.25(SPI_LE) ; port PLL_SPI_LE
PLL_SPI_MISO: DD3.22(SPI_MISO) ; port PLL_SPI_MISO
PLL_SPI_MOSI: DD3.23(SPI_MOSI) ; port PLL_SPI_MOSI
PLL_SYNC: DD3.14(~{SYNC}) ; port PLL_SYNC
NetC6_1: C6.1 ZQ2.3(OUT)
NetC6_2: C6.2 DD3.43(AUX_IN)
NetC24_2: C24.2 DD3.48(VBB)
NetC25_2: C25.2 DD3.38(REG_CAP2)
NetC26_2: C26.2 DD3.4(REG_CAP1)
NetC27_1: C27.1 C28.1 DD3.41(EXT_LFN)
NetC27_2: C27.2 R27.1
NetC28_2: C28.2 DD3.40(EXT_LFP) R27.2
NetC43_2: C43.2 DD3.44(VCC_AUXIN)
NetDD3_30: DD3.30(TESTOUTA) R28.2

Not connected (* = marked no-connect by the designer): DD3 6(U4P)* 7(U4N)* 12(~{POWER_DOWN})* 13(AUX_OUT)* 19(U1P) 20(U1N) 31(REF_SEL)* 33(TEST_MODE)* 45(PRI_REF+) 46(PRI_REF-); ZQ2 1(E)*

### Buses and harness runs
bus PLL_CLK0_N[1..2] = port PLL_CLK0_N[1..2] = sheet U_ADCLK/PLL_CLK0_N[1..2]
bus PLL_CLK0_P[1..2] = port PLL_CLK0_P[1..2] = sheet U_ADCLK/PLL_CLK0_P[1..2]
bus PLL_CLK_N[1..2] = port PLL_CLK_N[1..2]
bus PLL_CLK_P[1..2] = port PLL_CLK_P[1..2]

### Layout directives
differential pair: (no net found under the mark), EXT_LEMO_CLK_N, EXT_LEMO_CLK_P, PLL_CLK0_N, PLL_CLK0_P, PLL_CLK_N, PLL_CLK_P

### Notes on the sheet
- L3, L4, L5, L6 To measure and select the element.
- Project/Equipment
- Document
- Designer
- Drawn by
- Check.by
- Copyright WUT ISE 2024.
  This documentation describes Open Hardware and is licensed under the CERN OHL-W v.2.0. You may redistribute and modify this documentation under the terms of the CERN OHL-W v.2.0. (http://ohwr.org/CERNOHL). This documentation is distributed WITHOUT ANY EXPRESS OR IMPLIED WARRANTY, INCLUDING OF MERCHANTABILITY, SATISFACTORY QUALITY AND FITNESS FOR A PARTICULAR PURPOSE. Please see the CERN OHL v.2.0 for applicable conditions.
- Contact
- File
- Last Mod.
- Print Date
- Sheet
- Size
- A3
- of
- Rev

### Library data of the parts
C6 C40-C42 C105-C109 = CC0402_220NF_16V_10%_X7R: Non-polarised capacitor; Part Description: SMD Multilayer Chip Ceramic Capacitor; Manufacturer: GENERIC; Manufacturer1 Part Number: C1005X7R1C224K050; Voltage: 16V; TC: X7R; Tolerance: ±10%; Part Number: CC0402_220NF_16V_10%_X7R; Component Kind: Standard; Component Type: Standard; Pin Count: 2; Value: 220nF; Status: Preferred; Manufacturer Part Number: CC0402_220NF_16V_10%_X7R; Case: 0402; Mounted: Yes; Socket: No; SMD: Yes; Sense: No; Manufacturer1 Example: TDK; Manufacturer1 ComponentHeight: 0.55mm; HelpURL: \\cern.ch\dfs\Applications\Altium\Datasheets\CC0402_X7R_TDK_C.pdf; Author: CERN DEM JLC; CreateDate: 25.10.2012; LatestRevisionDate: 25.10.2012
C24 = CC0805_1UF_25V_10%_X7R: Non-polarised capacitor; Part Description: SMD Multilayer Chip Ceramic Capacitor; Manufacturer: GENERIC; Manufacturer1 Part Number: C0805C105K3RAC; Voltage: 25V; TC: X7R; Tolerance: ±10%; Part Number: CC0805_1UF_25V_10%_X7R; Component Kind: Standard; Component Type: Standard; Pin Count: 2; Value: 1uF; Status: Preferred; Manufacturer Part Number: CC0805_1UF_25V_10%_X7R; Case: 0805; Mounted: Yes; Socket: No; SMD: Yes; Sense: No; Manufacturer1 Example: KEMET; Manufacturer1 ComponentHeight: 1.4mm; HelpURL: \\cern.ch\dfs\Applications\Altium\Datasheets\CC0805_X7R_KEMET.pdf; Author: CERN DEM JLC; CreateDate: 23.03.2009; LatestRevisionDate: 23.03.2009
C25 C26 = CC0402_10UF_6.3V_20%_X5R: Non-polarised capacitor; Part Description: SMD Multilayer Chip Ceramic Capacitor; Manufacturer: GENERIC; Manufacturer1 Part Number: C1005X5R0J106M050BC; Voltage: 6.3V; TC: X5R; Tolerance: ±10%; Part Number: CC0402_10UF_6.3V_20%_X5R; Component Kind: Standard; Component Type: Standard; Pin Count: 2; Value: 10uF; Status: Preferred; Manufacturer Part Number: CC0402_10UF_6.3V_20%_X5R; Case: 0402; Mounted: Yes; Socket: No; SMD: Yes; Sense: No; Manufacturer1 Example: TDK; Manufacturer1 ComponentHeight: 0.70mm; HelpURL: \\cern.ch\dfs\Applications\Altium\Datasheets\CC0402_X5R_TDK_C.pdf; Author: CERN DEM JLC; CreateDate: 07.01.2015; LatestRevisionDate: 07.01.2015
C27 = CC0805_2.2UF_50V_10%_X7R: Non-polarised capacitor; Part Description: SMD Multilayer Chip Ceramic Capacitor; Manufacturer: GENERIC; Manufacturer1 Part Number: GRM21BR61H225KA73L; Voltage: 50V; TC: X7R; Tolerance: ±10%; Part Number: CC0805_2.2UF_50V_10%_X7R; Component Kind: Standard; Component Type: Standard; Pin Count: 2; Value: 2.2uF; Status: Preferred; Manufacturer Part Number: CC0805_2.2UF_50V_10%_X7R; Case: 0805; Mounted: Yes; Socket: No; SMD: Yes; Sense: No; Manufacturer1 Example: MURATA; Manufacturer1 ComponentHeight: 1.40mm; HelpURL: \\cern.ch\dfs\Applications\Altium\Datasheets\CC0805_X7R_MURATA_GRM.pdf; Author: CERN DEM JLC; CreateDate: 18.08.2014; LatestRevisionDate: 18.08.2014
C28 C30-C35 C43 C199 = CC0805_220NF_50V_10%_X7R: Non-polarised capacitor; Part Description: SMD Multilayer Chip Ceramic Capacitor; Manufacturer: GENERIC; Manufacturer1 Part Number: GRM21BR71H224KA01L; Voltage: 50V; TC: X7R; Tolerance: ±10%; Part Number: CC0805_220NF_50V_10%_X7R; Component Kind: Standard; Component Type: Standard; Pin Count: 2; Value: 220nF; Status: Preferred; Manufacturer Part Number: CC0805_220NF_50V_10%_X7R; Case: 0805; Mounted: Yes; Socket: No; SMD: Yes; Sense: No; Manufacturer1 Example: MURATA; Manufacturer1 ComponentHeight: 1.35mm; HelpURL: \\cern.ch\dfs\Applications\Altium\Datasheets\CC0805_X7R_MURATA.pdf; Author: CERN DEM JLC; CreateDate: 03.12.2007; LatestRevisionDate: 03.12.2007
DD3 = CDCE62005RGZT: 5/10 Outputs Clock Generator/Jitter Cleaner with Integrated Dual VCO; Manufacturer: TEXAS INSTRUMENTS; PressFit: No; Bonding: No; Part Number: CDCE62005RGZT; Component Kind: Standard; Component Type: Standard; Device: CDCE62005RGZT; PackageDescription: QFN, 0.50mm Pitch, Square; 48 Pin, 7.00mm L X 7.00mm W X 1.00mm H body (w/Thermal Tab 5.70 X 5.70mm), IPC Medium Density; Part Description: 5/10 Outputs Clock Generator/Jitter Cleaner with Integrated Dual VCO; Manufacturer Part Number: CDCE62005RGZ; Pin Count: 49; Case: QFN48; Mounted: Yes; Socket: No; SMD: Yes; Sense: No; ComponentHeight: 1mm; HelpURL: \\cern.ch\dfs\Applications\Altium\Datasheets\CDCE62005RGZT.pdf; Author: CERN DEM JLC; CreateDate: 21.11.2011; LatestRevisionDate: 10.06.2022
L3-L6 = IND0805_TDK_MPZ2012S221A: Part Description: SMT Chip Bead for General Power Line (MPZ Series); Manufacturer: TDK; Power: 3A; Resistance: 0.04R; Tolerance: ±25%; Part Number: IND0805_TDK_MPZ2012S221A; Component Kind: Standard; Component Type: Standard; Pin Count: 2; Value: 220R@100MHz; Manufacturer Part Number: MPZ2012S221A; Case: 0805; Mounted: Yes; Socket: No; SMD: Yes; Sense: No; ComponentHeight: 1.05mm; HelpURL: \\cern.ch\dfs\Applications\Altium\Datasheets\IND0805_TDK_MPZ2012.pdf; Author: CERN DEM HF; CreateDate: 04.10.2021; LatestRevisionDate: 04.10.2021
R27 = R0402_33R_1%_0.0625W_100PPM: Resistor - 1%; Part Description: General Purpose Thick Film Chip Resistor; Manufacturer: GENERIC; Manufacturer1 Part Number: 232270673309L; TC: ±100ppm/°C; PressFit: No; Part Number: R0402_33R_1%_0.0625W_100PPM; Component Kind: Standard; Component Type: Standard; Pin Count: 2; Value: 33; Status: Not Recommended; Power: 0.0625W; Manufacturer Part Number: R0402_33R_1%_0.0625W_100PPM; Case: 0402; Mounted: Yes; Sense: No; Socket: No; SMD: Yes; Manufacturer1 Example: YAGEO PHYCOMP; Manufacturer1 ComponentHeight: 0.4mm; HelpURL: \\cern.ch\dfs\Applications\Altium\Datasheets\R0402_Phycomp_RC0402.pdf; Author: CERN DEM JLC; CreateDate: 03.12.2007; LatestRevisionDate: 17.10.2012
R28 = R0402_1K_1%_0.0625W_100PPM: Resistor - 1%; Part Description: General Purpose Thick Film Chip Resistor; Manufacturer: GENERIC; Manufacturer1 Part Number: 232270671002L; TC: ±100ppm/°C; PressFit: No; Part Number: R0402_1K_1%_0.0625W_100PPM; Component Kind: Standard; Component Type: Standard; Pin Count: 2; Value: 1k; Status: Not Recommended; Power: 0.0625W; Manufacturer Part Number: R0402_1K_1%_0.0625W_100PPM; Case: 0402; Mounted: Yes; Sense: No; Socket: No; SMD: Yes; Manufacturer1 Example: YAGEO PHYCOMP; Manufacturer1 ComponentHeight: 0.4mm; HelpURL: \\cern.ch\dfs\Applications\Altium\Datasheets\R0402_Phycomp_RC0402.pdf; Author: CERN DEM JLC; CreateDate: 03.12.2007; LatestRevisionDate: 17.10.2012
X8 = LEMO_EPG.00.302.NLN: Part Description: Size 00, Elbow Socket (90°) with 2 Female Contacts and Alignment Key (G); PressFit: No; SCEM: 09.31.28.007.2; Part Number: LEMO_EPG.00.302.NLN; Component Kind: Standard; Component Type: Standard; Pin Count: 3; Family: LEMO 00; Mounted: Yes; Socket: No; SMD: No; Sense: No; Status: None; Manufacturer: LEMO; Manufacturer Part Number: EPG.00.302.NLN; ComponentHeight: 7mm; HelpURL: \\cern.ch\dfs\Applications\Altium\Datasheets\LEMO_EPG.00.302.NLN.pdf; Author: CERN DEM JLC; CreateDate: 25.08.2010; LatestRevisionDate: 20.12.2010
ZQ2 = OSC_40MHZ_IQD_LFSPXO018042: Oscillator 4 pins 1=E 2=GND 3=OUT 4=+Vs; Part Description: 3.3V, ±50ppm, 50pF, 0..70°C, HCMOS Surface Mount Clock Oscillator (CFPS-73 Series); Manufacturer: IQD FREQUENCY PRODUCTS; PressFit: No; Bonding: No; Part Number: OSC_40MHZ_IQD_LFSPXO018042; Component Kind: Standard; Component Type: Standard; PackageDescription: Oscillator, Side Concave, 5.08mm Pitch, 4 Pins, 5.00mm L X 7.00mm W X 1.40mm H, CFPS-73 Series; Value: 40MHz; Manufacturer Part Number: LFSPXO018042; Pin Count: 4; Mounted: Yes; Socket: No; SMD: Yes; Sense: No; ComponentHeight: 1.4mm; HelpURL: \\cern.ch\dfs\Applications\Altium\Datasheets\OSC_IQD_LFSPXO018042.pdf; Author: CERN DEM JLC; CreateDate: 22.08.2011; LatestRevisionDate: 03.11.2016

## Sheet ADCLK.SchDoc: FIT_PM12 board
size 420 x 297 mm; CheckedBy: G.Kasprowicz; Author: INR Moscow; CompanyName: WUT ISE; DrawnBy: M.Podgórski; Organization: WUT ISE; Address1: PW ISE; Address2: Nowowiejska 15/19 00-665 Warsaw; Address3: gkasprow@gmail.com; DocumentNumber: 10; Revision: 2; SheetNumber: 3; SheetTotal: 18; ModifiedBy: -; CheckedDate: -; Title2: clock distribution; DivGrp: WUT ISE; Designer: INR RAS; ModifiedDate: -; ProjectName: Sensor Box
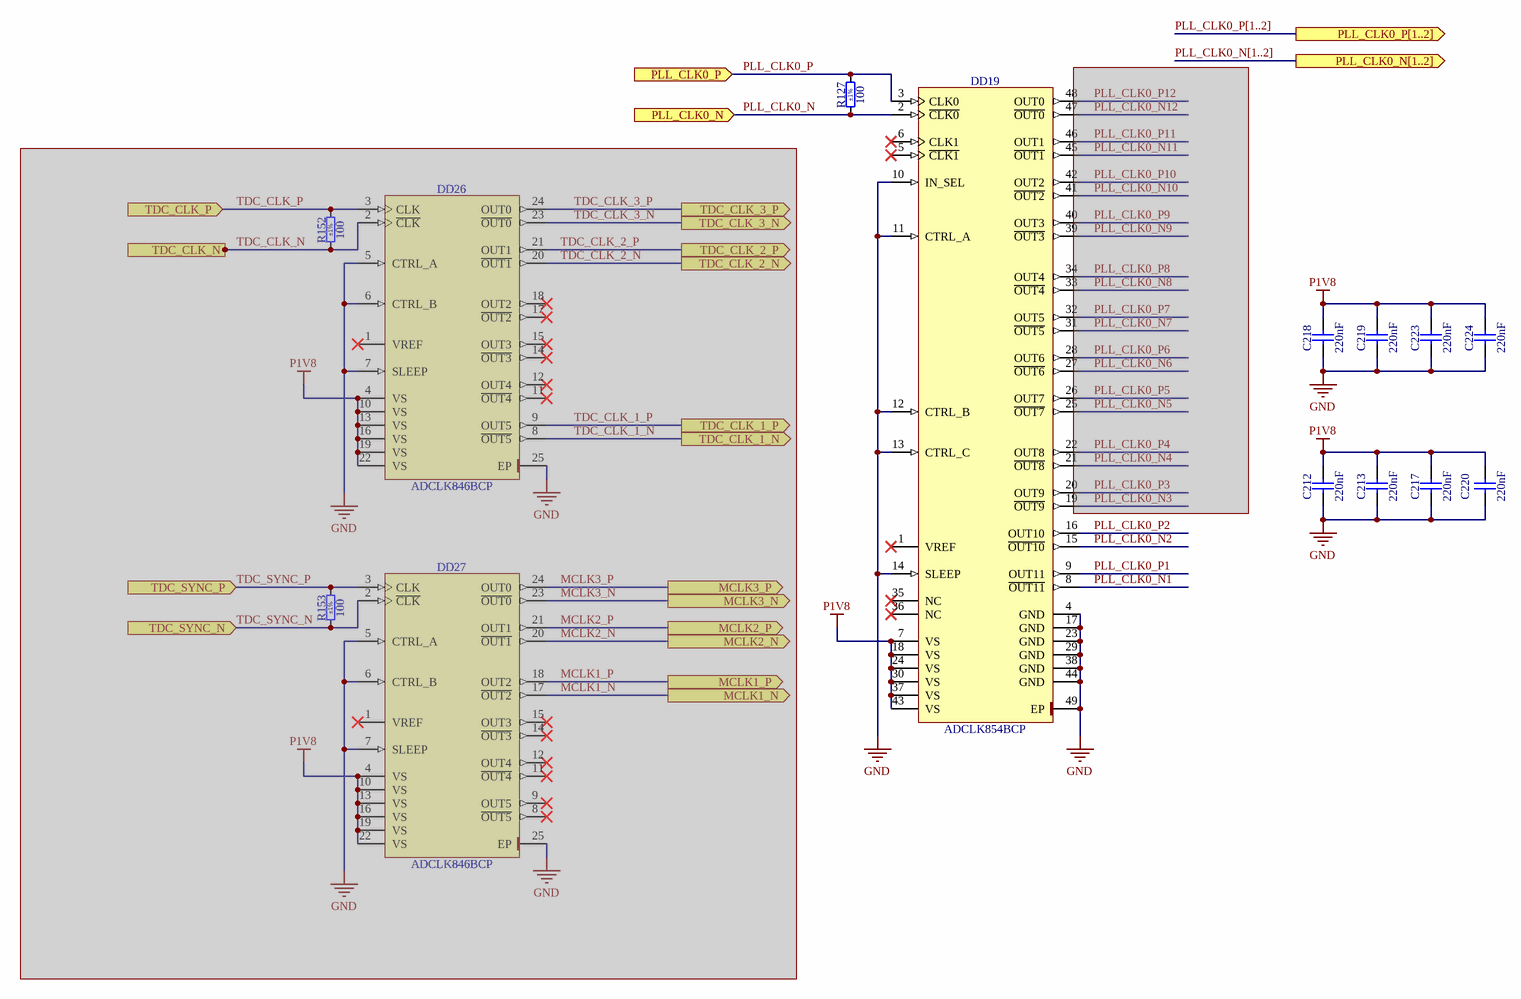
[diagram p2: ADCLK.SchDoc]

### Parts
C212  220nF  [CAPC2012X135N]
C213  220nF  [CAPC2012X135N]
C217  220nF  [CAPC2012X135N]
C218  220nF  [CAPC2012X135N]
C219  220nF  [CAPC2012X135N]
C220  220nF  [CAPC2012X135N]
C223  220nF  [CAPC2012X135N]
C224  220nF  [CAPC2012X135N]
DD19  ADCLK854BCP  [QFN50P700X700X80-49N-S290]
DD26  ADCLK846BCP  [QFN50P400X400X80-25N-S245]  (masked out: inside a compile mask, not in the netlist)
DD27  ADCLK846BCP  [QFN50P400X400X80-25N-S245]  (masked out: inside a compile mask, not in the netlist)
R127  100  Tolerance: ±1%  [RESC1608X55N]
R152  100  Tolerance: ±1%  [RESC1608X55N]  (masked out: inside a compile mask, not in the netlist)
R153  100  Tolerance: ±1%  [RESC1608X55N]  (masked out: inside a compile mask, not in the netlist)

### Ports
MCLK1_N (out), MCLK1_P (out), MCLK2_N (out), MCLK2_P (out), MCLK3_N (out), MCLK3_P (out), PLL_CLK0_N (in), PLL_CLK0_N[1..2] (out), PLL_CLK0_P (in), PLL_CLK0_P[1..2] (out), TDC_CLK_1_N (out), TDC_CLK_1_P (out), TDC_CLK_2_N (out), TDC_CLK_2_P (out), TDC_CLK_3_N (out), TDC_CLK_3_P (out), TDC_CLK_N (in), TDC_CLK_P (in), TDC_SYNC_N (in), TDC_SYNC_P (in)

### Nets
GND: C212.1 C213.1 C217.1 C218.1 C219.1 C220.1 C223.1 C224.1 DD19.4(GND) DD19.10(IN_SEL) DD19.11(CTRL_A) DD19.12(CTRL_B) DD19.13(CTRL_C) DD19.14(SLEEP) DD19.17(GND) DD19.23(GND) DD19.29(GND) DD19.38(GND) DD19.44(GND) DD19.49(EP)
P1V8: C212.2 C213.2 C217.2 C218.2 C219.2 C220.2 C223.2 C224.2 DD19.7(VS) DD19.18(VS) DD19.24(VS) DD19.30(VS) DD19.37(VS) DD19.43(VS)
PLL_CLK0_N: DD19.2(~{CLK0}) R127.1 ; port PLL_CLK0_N
PLL_CLK0_N1: DD19.8(~{OUT11})  [project net PLL_CLK0_N]
PLL_CLK0_N2: DD19.15(~{OUT10})  [project net PLL_CLK0_N]
PLL_CLK0_P: DD19.3(CLK0) R127.2 ; port PLL_CLK0_P
PLL_CLK0_P1: DD19.9(OUT11)  [project net PLL_CLK0_P]
PLL_CLK0_P2: DD19.16(OUT10)  [project net PLL_CLK0_P]

Not connected (* = marked no-connect by the designer): DD19 1(VREF)* 5(~{CLK1})* 6(CLK1)* 19(~{OUT9}) 20(OUT9) 21(~{OUT8}) 22(OUT8) 25(~{OUT7}) 26(OUT7) 27(~{OUT6}) 28(OUT6) 31(~{OUT5}) 32(OUT5) 33(~{OUT4}) 34(OUT4) 35(NC)* 36(NC)* 39(~{OUT3}) 40(OUT3) 41(~{OUT2}) 42(OUT2) 45(~{OUT1}) 46(OUT1) 47(~{OUT0}) 48(OUT0)

### Buses and harness runs
bus PLL_CLK0_N[1..2] = port PLL_CLK0_N[1..2]
bus PLL_CLK0_P[1..2] = port PLL_CLK0_P[1..2]

### Notes on the sheet
- Project/Equipment
- Document
- Designer
- Drawn by
- Check.by
- Copyright WUT ISE 2024.
  This documentation describes Open Hardware and is licensed under the CERN OHL-W v.2.0. You may redistribute and modify this documentation under the terms of the CERN OHL-W v.2.0. (http://ohwr.org/CERNOHL). This documentation is distributed WITHOUT ANY EXPRESS OR IMPLIED WARRANTY, INCLUDING OF MERCHANTABILITY, SATISFACTORY QUALITY AND FITNESS FOR A PARTICULAR PURPOSE. Please see the CERN OHL v.2.0 for applicable conditions.
- Contact
- File
- Last Mod.
- Print Date
- Sheet
- Size
- A3
- of
- Rev

### Library data of the parts
C212 C213 C217-C220 C223 C224 = CC0805_220NF_50V_10%_X7R: as C28 on sheet Main_PLL; Part Number: CC0805_220NF_50V_10%_X7R; Component Kind: Standard; Component Type: Standard; Pin Count: 2; Value: 220nF; Status: Preferred; Manufacturer Part Number: CC0805_220NF_50V_10%_X7R; Case: 0805; Mounted: Yes; Socket: No; SMD: Yes; Sense: No; Manufacturer1 Example: MURATA; Manufacturer1 ComponentHeight: 1.35mm; HelpURL: \\cern.ch\dfs\Applications\Altium\Datasheets\CC0805_X7R_MURATA.pdf; Author: CERN DEM JLC; CreateDate: 03.12.2007; LatestRevisionDate: 03.12.2007
DD19 = ADCLK854BCP: 1.8 V, 6 LVDS/12 CMOS Outputs Low Power Clock Fanout Buffer; Manufacturer: ANALOG DEVICES; PressFit: No; Bonding: No; Part Number: ADCLK854BCP; Component Kind: Standard; Component Type: Standard; Device: ADCLK854BCP; PackageDescription: QFN, 0.50mm Pitch, Square; 48 Pin, 7.00mm L X 7.00mm W X 0.80mm H body (w/Thermal Tab 2.9 x 2.9mm), IPC Medium Density; Part Description: 1.8 V, 6 LVDS/12 CMOS Outputs Low Power Clock Fanout Buffer; Manufacturer Part Number: ADCLK854BCP; Pin Count: 49; Case: QFN48; Mounted: Yes; Socket: No; SMD: Yes; Sense: No; ComponentHeight: 0.8mm; Author: CERN DEM HF; HelpURL: \\cern.ch\dfs\Applications\Altium\Datasheets\ADCLK854BCP.pdf; CreateDate: 24.05.2024; LatestRevisionDate: 24.05.2024
DD26 DD27 = ADCLK846BCP: 1.8 V, 6 LVDS/12 CMOS Outputs Low Power Clock Fanout Buffer; Manufacturer: ANALOG DEVICES; PressFit: No; Bonding: No; Part Number: ADCLK846BCP; Component Kind: Standard; Component Type: Standard; Device: ADCLK846BCP; PackageDescription: QFN, 0.50mm Pitch, Square; 24 Pin, 4.00mm L X 4.00mm W X 0.80mm H body (w/Thermal Tab 2.45 x 2.45mm), IPC Medium Density; Part Description: 1.8 V, 6 LVDS/12 CMOS Outputs Low Power Clock Fanout Buffer; Manufacturer Part Number: ADCLK846BCP; Pin Count: 25; Case: QFN24; Mounted: Yes; Socket: No; SMD: Yes; Sense: No; ComponentHeight: 0.8mm; Author: CERN DEM HF; HelpURL: \\cern.ch\dfs\Applications\Altium\Datasheets\ADCLK846BCP.pdf; CreateDate: 23.05.2024; LatestRevisionDate: 23.05.2024
R127 R152 R153 = R0603_100R_1%_0.1W_100PPM: Resistor - 1%; Part Description: General Purpose Thick Film Chip Resistor; Manufacturer: GENERIC; Manufacturer1 Part Number: NRC06F4700TRF; Power: 0.1W; TC: ±100ppm/°C; PressFit: No; Part Number: R0603_100R_1%_0.1W_100PPM; Component Kind: Standard; Component Type: Standard; Pin Count: 2; Value: 100; Status: Preferred; Manufacturer Part Number: R0603_100R_1%_0.1W_100PPM; Case: 0603; Mounted: Yes; Sense: No; Socket: No; SMD: Yes; Manufacturer1 Example: NIC COMPONENT; Manufacturer1 ComponentHeight: 0.55mm; HelpURL: \\cern.ch\dfs\Applications\Altium\Datasheets\R0603_NIC_NRC.pdf; Author: CERN DEM JLC; CreateDate: 03.12.2007; LatestRevisionDate: 13.03.2008

## Sheet PM12_Power.SchDoc: FIT_PM12 board
size 420 x 297 mm; CheckedBy: G.Kasprowicz; Author: INR Moscow; CompanyName: WUT ISE; DrawnBy: M.Podgórski; Organization: WUT ISE; Address1: PW ISE; Address2: Nowowiejska 15/19 00-665 Warsaw; Address3: gkasprow@gmail.com; DocumentNumber: 11; Revision: 2; SheetNumber: 10; SheetTotal: 25; ModifiedBy: -; CheckedDate: -; Title2: PSU subsystem; DivGrp: WUT ISE; Designer: INR RAS; ModifiedDate: -; ProjectName: Sensor Box
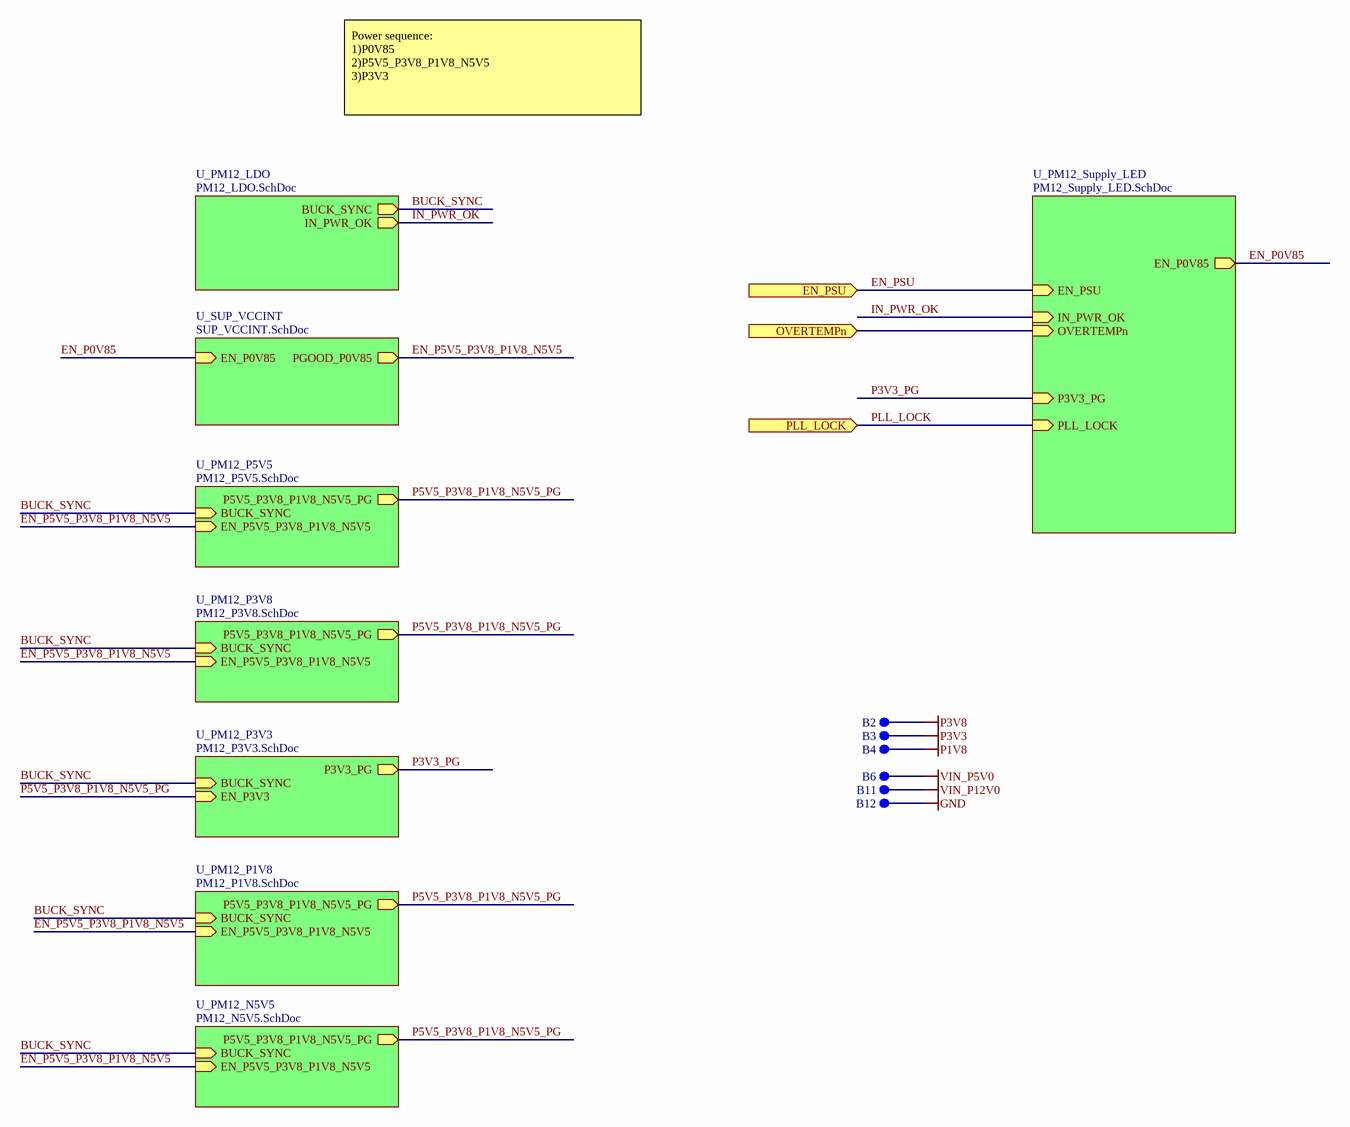
[diagram p3: PM12_Power.SchDoc]

### Parts
B2  SMD Pad  [C100]  (value not drawn)  (no BOM)
B3  SMD Pad  [C100]  (value not drawn)  (no BOM)
B4  SMD Pad  [C100]  (value not drawn)  (no BOM)
B6  SMD Pad  [C100]  (value not drawn)  (no BOM)
B11  SMD Pad  [C100]  (value not drawn)  (no BOM)
B12  SMD Pad  [C100]  (value not drawn)  (no BOM)

### Sub-sheets
U_PM12_LDO = PM12_LDO.SchDoc: IN_PWR_OK (out), BUCK_SYNC (out)
U_PM12_N5V5 = PM12_N5V5.SchDoc: BUCK_SYNC (in), EN_P5V5_P3V8_P1V8_N5V5 (in), P5V5_P3V8_P1V8_N5V5_PG (out)
U_PM12_P1V8 = PM12_P1V8.SchDoc: BUCK_SYNC (in), EN_P5V5_P3V8_P1V8_N5V5 (in), P5V5_P3V8_P1V8_N5V5_PG (out)
U_PM12_P3V3 = PM12_P3V3.SchDoc: BUCK_SYNC (in), EN_P3V3 (in), P3V3_PG (out)
U_PM12_P3V8 = PM12_P3V8.SchDoc: BUCK_SYNC (in), EN_P5V5_P3V8_P1V8_N5V5 (in), P5V5_P3V8_P1V8_N5V5_PG (out)
U_PM12_P5V5 = PM12_P5V5.SchDoc: BUCK_SYNC (in), EN_P5V5_P3V8_P1V8_N5V5 (in), P5V5_P3V8_P1V8_N5V5_PG (out)
U_PM12_Supply_LED = PM12_Supply_LED.SchDoc: IN_PWR_OK (in), PLL_LOCK (in), EN_PSU (in), EN_P0V85 (out), P3V3_PG (in), OVERTEMPn (in)
U_SUP_VCCINT = SUP_VCCINT.SchDoc: EN_P0V85 (in), PGOOD_P0V85 (out)

### Ports
EN_PSU (in), OVERTEMPn (in), PLL_LOCK (in)

### Nets
GND: B12.1
P1V8: B4.1
P3V3: B3.1
P3V8: B2.1
VIN_P5V0: B6.1
VIN_P12V0: B11.1
BUCK_SYNC: sheet U_PM12_LDO/BUCK_SYNC, sheet U_PM12_P3V8/BUCK_SYNC, sheet U_PM12_P3V3/BUCK_SYNC, sheet U_PM12_N5V5/BUCK_SYNC, sheet U_PM12_P5V5/BUCK_SYNC, sheet U_PM12_P1V8/BUCK_SYNC
EN_P0V85: sheet U_PM12_Supply_LED/EN_P0V85, sheet U_SUP_VCCINT/EN_P0V85
EN_P5V5_P3V8_P1V8_N5V5: sheet U_PM12_P3V8/EN_P5V5_P3V8_P1V8_N5V5, sheet U_PM12_N5V5/EN_P5V5_P3V8_P1V8_N5V5, sheet U_PM12_P5V5/EN_P5V5_P3V8_P1V8_N5V5, sheet U_PM12_P1V8/EN_P5V5_P3V8_P1V8_N5V5, sheet U_SUP_VCCINT/PGOOD_P0V85
EN_PSU: port EN_PSU, sheet U_PM12_Supply_LED/EN_PSU
IN_PWR_OK: sheet U_PM12_LDO/IN_PWR_OK, sheet U_PM12_Supply_LED/IN_PWR_OK
OVERTEMPn: port OVERTEMPn, sheet U_PM12_Supply_LED/OVERTEMPn
P3V3_PG: sheet U_PM12_Supply_LED/P3V3_PG, sheet U_PM12_P3V3/P3V3_PG
P5V5_P3V8_P1V8_N5V5_PG: sheet U_PM12_P3V8/P5V5_P3V8_P1V8_N5V5_PG, sheet U_PM12_P3V3/EN_P3V3, sheet U_PM12_N5V5/P5V5_P3V8_P1V8_N5V5_PG, sheet U_PM12_P5V5/P5V5_P3V8_P1V8_N5V5_PG, sheet U_PM12_P1V8/P5V5_P3V8_P1V8_N5V5_PG  [project net EN_P3V3]
PLL_LOCK: port PLL_LOCK, sheet U_PM12_Supply_LED/PLL_LOCK

### Notes on the sheet
- Power sequence:
  1)P0V85
  2)P5V5_P3V8_P1V8_N5V5
  3)P3V3
- Project/Equipment
- Document
- Designer
- Drawn by
- Check.by
- Copyright WUT ISE 2024.
  This documentation describes Open Hardware and is licensed under the CERN OHL-W v.2.0. You may redistribute and modify this documentation under the terms of the CERN OHL-W v.2.0. (http://ohwr.org/CERNOHL). This documentation is distributed WITHOUT ANY EXPRESS OR IMPLIED WARRANTY, INCLUDING OF MERCHANTABILITY, SATISFACTORY QUALITY AND FITNESS FOR A PARTICULAR PURPOSE. Please see the CERN OHL v.2.0 for applicable conditions.
- Contact
- File
- Last Mod.
- Print Date
- Sheet
- Size
- A3
- of
- Rev

### Library data of the parts
B2-B4 B6 B11 B12 = SMD_PAD_D1MM: Pad; Part Description: 1mm Diameter SMD Pad; Mounted: No; Part Number: SMD_PAD_D1MM; Component Type: Standard (No BOM); Pin Count: 1; Family: SMD Pad; Socket: No; SMD: Yes; Sense: No; Status: None; ComponentHeight: 0mm; HelpURL: Undefined; Author: CERN DEM JLC; CreateDate: 10.10.2017; LatestRevisionDate: 10.10.2017; PackageDescription: 1mm Diameter SMD Pad

## Sheet PM12_LDO.SchDoc: FIT_PM12 board
size 420 x 297 mm; CheckedBy: G.Kasprowicz; Author: INR Moscow; CompanyName: WUT ISE; DrawnBy: M.Podgórski; Organization: WUT ISE; Address1: PW ISE; Address2: Nowowiejska 15/19 00-665 Warsaw; Address3: gkasprow@gmail.com; DocumentNumber: 12; Revision: 2; SheetNumber: 11; SheetTotal: 21; ModifiedBy: -; CheckedDate: -; Title2: LDOs; DivGrp: WUT ISE; Designer: INR RAS; ModifiedDate: -; ProjectName: Sensor Box
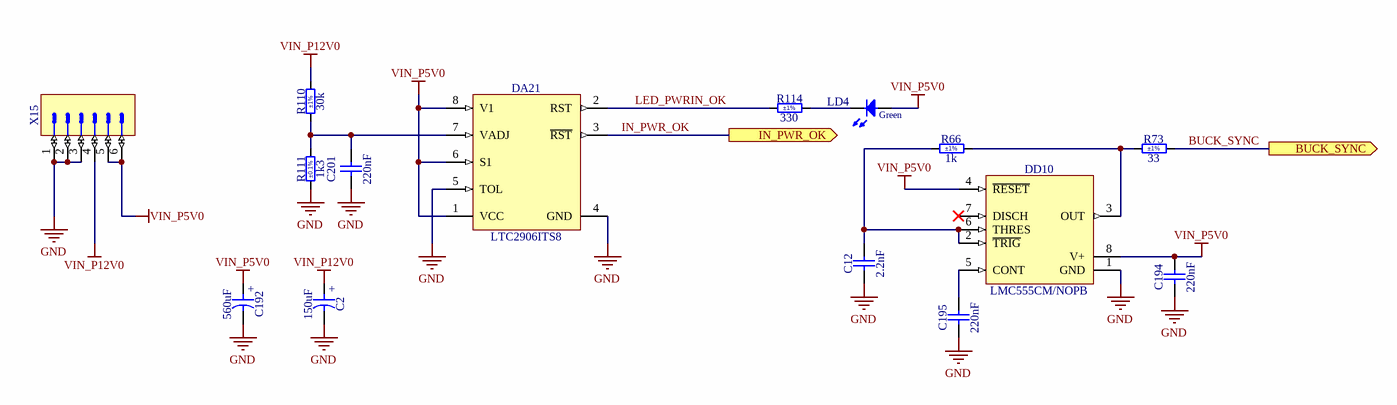
[diagram p4: PM12_LDO.SchDoc]

### Parts
C2  150uF  [CAPAE830X1020N]
C12  2.2nF  [CAPC2013X100N]
C192  560uF  [CAPAE830X1020N]
C194  220nF  [CAPC2012X135N]
C195  220nF  [CAPC2012X135N]
C201  220nF  [CAPC2012X135N]
DA21  LTC2906ITS8  [SOT65P280X100-8N]
DD10  LMC555CM/NOPB  [SOIC127P600X175-8N]
LD4  Green  [LED_KINGBRIGHT_KPH-1608CGCK]
R66  1k  Tolerance: ±1%  [RESC1005X40N]
R73  33  Tolerance: ±1%  [RESC1005X40N]
R110  30k  Tolerance: ±1%  [RESC2012X60N]
R111  1k3  Tolerance: ±0.1%  [RESC2012X60N]
R114  330  Tolerance: ±1%  [RESC1005X40N]
X15  Mini-Fit BMI  [MOLEX_15-24-9067]  (value not drawn)

### Ports
BUCK_SYNC (out), IN_PWR_OK (out)

### Nets
GND: C2.2 C12.1 C192.2 C194.1 C195.1 C201.1 DA21.4(GND) DA21.5(TOL) DD10.1(GND) R111.1 X15.1 X15.2 X15.3
VIN_P5V0: C192.1 C194.2 DA21.1(VCC) DA21.6(S1) DA21.8(V1) DD10.4(~{RESET}) DD10.8(V+) LD4.2(A) X15.5 X15.6
VIN_P12V0: C2.1 R110.2 X15.4
BUCK_SYNC: R73.2 ; port BUCK_SYNC
IN_PWR_OK: DA21.3(~{RST}) ; port IN_PWR_OK
LED_PWRIN_OK: DA21.2(RST) R114.1
NetC12_2: C12.2 DD10.2(~{TRIG}) DD10.6(THRES) R66.1
NetC195_2: C195.2 DD10.5(CONT)
NetC201_2: C201.2 DA21.7(VADJ) R110.1 R111.2
NetDD10_3: DD10.3(OUT) R66.2 R73.1
NetLD4_1: LD4.1(C) R114.2

Not connected (* = marked no-connect by the designer): DD10 7(DISCH)*

### Notes on the sheet
- Project/Equipment
- Document
- Designer
- Drawn by
- Check.by
- Copyright WUT ISE 2024.
  This documentation describes Open Hardware and is licensed under the CERN OHL-W v.2.0. You may redistribute and modify this documentation under the terms of the CERN OHL-W v.2.0. (http://ohwr.org/CERNOHL). This documentation is distributed WITHOUT ANY EXPRESS OR IMPLIED WARRANTY, INCLUDING OF MERCHANTABILITY, SATISFACTORY QUALITY AND FITNESS FOR A PARTICULAR PURPOSE. Please see the CERN OHL v.2.0 for applicable conditions.
- Contact
- File
- Last Mod.
- Print Date
- Sheet
- Size
- A3
- of
- Rev
- (in symbol CAE830-1020_150UF_25V_20%) +
- (in symbol CAE830-1020_560UF_10V_20%) +

### Library data of the parts
C2 = CAE830-1020_150UF_25V_20%: Polarised capacitor; Part Description: Aluminum Electrolytic SMT Capacitor; Manufacturer: PANASONIC; Manufacturer Part Number: EEEFP1E151AP; Voltage: 25V; Tolerance: ±20%; Part Number: CAE830-1020_150UF_25V_20%; Component Kind: Standard; Component Type: Standard; Pin Count: 2; Value: 150uF; Status: Not Recommended; Case: F; Mounted: Yes; Socket: No; SMD: Yes; Sense: No; ComponentHeight: 10.2mm; HelpURL: \\cern.ch\dfs\Applications\Altium\Datasheets\CAE_PANASONIC_FP.pdf; Author: CERN DEM HF; CreateDate: 24.05.2024; LatestRevisionDate: 24.05.2024
C12 = CC0805_2.2NF_50V_5%_C0G: Non-polarised capacitor; Part Description: SMD Multilayer Chip Ceramic Capacitor; Manufacturer: GENERIC; Manufacturer1 Part Number: C0805C222J5GACTU; Voltage: 50V; TC: C0G/NP0; Tolerance: ±5%; Part Number: CC0805_2.2NF_50V_5%_C0G; Component Kind: Standard; Component Type: Standard; Pin Count: 2; Value: 2.2nF; Status: None; Manufacturer Part Number: CC0805_2.2NF_50V_5%_C0G; Case: 0805; Mounted: Yes; Socket: No; SMD: Yes; Sense: No; Manufacturer1 Example: KEMET; Manufacturer1 ComponentHeight: 0.88mm; HelpURL: \\cern.ch\dfs\Applications\Altium\Datasheets\CC0805_C0G_KEMET_(Commercial Grade).pdf; Author: CERN DEM MR; CreateDate: 26.01.2016; LatestRevisionDate: 26.01.2016
C192 = CAE830-1020_560UF_10V_20%: Polarised capacitor; Part Description: Aluminum Electrolytic SMT Capacitor; Manufacturer: PANASONIC; Manufacturer Part Number: EEEFH1A561L; Voltage: 10V; Tolerance: ±20%; Part Number: CAE830-1020_560UF_10V_20%; Component Kind: Standard; Component Type: Standard; Pin Count: 2; Value: 560uF; Status: Not Recommended; Case: F; Mounted: Yes; Socket: No; SMD: Yes; Sense: No; ComponentHeight: 10.2mm; HelpURL: \\cern.ch\dfs\Applications\Altium\Datasheets\CAE_PANASONIC_FH.pdf; Author: CERN DEM HF; CreateDate: 24.05.2024; LatestRevisionDate: 24.05.2024
C194 C195 C201 = CC0805_220NF_50V_10%_X7R: as C28 on sheet Main_PLL; Part Number: CC0805_220NF_50V_10%_X7R; Component Kind: Standard; Component Type: Standard; Pin Count: 2; Value: 220nF; Status: Preferred; Manufacturer Part Number: CC0805_220NF_50V_10%_X7R; Case: 0805; Mounted: Yes; Socket: No; SMD: Yes; Sense: No; Manufacturer1 Example: MURATA; Manufacturer1 ComponentHeight: 1.35mm; HelpURL: \\cern.ch\dfs\Applications\Altium\Datasheets\CC0805_X7R_MURATA.pdf; Author: CERN DEM JLC; CreateDate: 03.12.2007; LatestRevisionDate: 03.12.2007
DA21 = LTC2906ITS8: Precision Dual Supply Monitors with One Pin-Selectable Threshold and One Adjustable Input; Manufacturer: LINEAR TECHNOLOGY; PressFit: No; Bonding: No; Part Number: LTC2906ITS8; Component Kind: Standard; Component Type: Standard; Device: LTC2906ITS8; PackageDescription: SOT, 0.65mm Pitch; 8 Pin, 1.625mm W X 2.90mm L X 1.00mm H Body, IPC Medium Density; Part Description: Precision Dual Supply Monitors with One Pin-Selectable Threshold and One Adjustable Input; Manufacturer Part Number: LTC2906ITS8; Pin Count: 8; Case: SOT23-8; Mounted: Yes; Socket: No; SMD: Yes; Sense: No; ComponentHeight: 1mm; Author: CERN DEM HF; HelpURL: \\cern.ch\dfs\Applications\Altium\Datasheets\LTC2906.pdf; CreateDate: 05.06.2024; LatestRevisionDate: 05.06.2024
DD10 = LMC555CM/NOPB: CMOS Timer; Manufacturer: NATIONAL SEMICONDUCTOR; PressFit: No; Bonding: No; Part Number: LMC555CM/NOPB; Component Kind: Standard; Component Type: Standard; Device: LMC555CM/NOPB; PackageDescription: SOIC 8, Pitch 1.27mm, Body 4x5mm, IPC Medium Density; Part Description: CMOS Timer; Manufacturer Part Number: LMC555CM; Pin Count: 8; Case: SOIC8; Mounted: Yes; Socket: No; SMD: Yes; Sense: No; ComponentHeight: 1.75mm; Author: CERN DEM JLC; HelpURL: \\cern.ch\dfs\Applications\Altium\Datasheets\LMC555C-NOPB.pdf; CreateDate: 12.04.2010; LatestRevisionDate: 01.06.2022
LD4 = LED_KINGBRIGHT_KPH-1608CGCK: LED Green 1C 2A; Part Description: SMD Green LED, Case 1.6mmX0.8mm(0603), 0.65mm Thickness; PressFit: No; Bonding: No; Part Number: LED_KINGBRIGHT_KPH-1608CGCK; Component Kind: Standard; Component Type: Standard; Color: Green; PackageDescription: SMT Green LED, Case 0603, Body L 1.6 x W 0.8mm H 0.65mm; Manufacturer: KINGBRIGHT; Manufacturer Part Number: KPH-1608CGCK; Pin Count: 2; Case: 0603; Mounted: Yes; Socket: No; SMD: Yes; Sense: No; ComponentHeight: 0.65mm; HelpURL: \\cern.ch\dfs\Applications\Altium\Datasheets\LED_KINGBRIGHT_KPH-1608CGCK.pdf; Author: CERN DEM JLC; CreateDate: 03.07.2017; LatestRevisionDate: 03.07.2017
R66 = R0402_1K_1%_0.0625W_100PPM: as R28 on sheet Main_PLL; Part Number: R0402_1K_1%_0.0625W_100PPM; Component Kind: Standard; Component Type: Standard; Pin Count: 2; Value: 1k; Status: Not Recommended; Power: 0.0625W; Manufacturer Part Number: R0402_1K_1%_0.0625W_100PPM; Case: 0402; Mounted: Yes; Sense: No; Socket: No; SMD: Yes; Manufacturer1 Example: YAGEO PHYCOMP; Manufacturer1 ComponentHeight: 0.4mm; HelpURL: \\cern.ch\dfs\Applications\Altium\Datasheets\R0402_Phycomp_RC0402.pdf; Author: CERN DEM JLC; CreateDate: 03.12.2007; LatestRevisionDate: 17.10.2012
R73 = R0402_33R_1%_0.0625W_100PPM: as R27 on sheet Main_PLL; Part Number: R0402_33R_1%_0.0625W_100PPM; Component Kind: Standard; Component Type: Standard; Pin Count: 2; Value: 33; Status: Not Recommended; Power: 0.0625W; Manufacturer Part Number: R0402_33R_1%_0.0625W_100PPM; Case: 0402; Mounted: Yes; Sense: No; Socket: No; SMD: Yes; Manufacturer1 Example: YAGEO PHYCOMP; Manufacturer1 ComponentHeight: 0.4mm; HelpURL: \\cern.ch\dfs\Applications\Altium\Datasheets\R0402_Phycomp_RC0402.pdf; Author: CERN DEM JLC; CreateDate: 03.12.2007; LatestRevisionDate: 17.10.2012
R110 = R0805_30K_1%_0.125W_100PPM: Resistor - 1%; Part Description: General Purpose Thick Film Chip Resistor; Manufacturer: GENERIC; Manufacturer1 Part Number: NRC10F3002TRF; Power: 0.125W; TC: ±100ppm/°C; PressFit: No; Part Number: R0805_30K_1%_0.125W_100PPM; Component Kind: Standard; Component Type: Standard; Pin Count: 2; Value: 30k; Status: Preferred; Manufacturer Part Number: R0805_30K_1%_0.125W_100PPM; Case: 0805; Mounted: Yes; Sense: No; Socket: No; SMD: Yes; Manufacturer1 Example: NIC COMPONENT; Manufacturer1 ComponentHeight: 0.6mm; HelpURL: \\cern.ch\dfs\Applications\Altium\Datasheets\R0805_NIC_NRC.pdf; Author: CERN DEM JLC; CreateDate: 03.12.2007; LatestRevisionDate: 13.03.2008
R111 = R0805_1K3_0.1%_0.1W_10PPM: Resistor - 0.1%; Part Description: Thin Film Chip Resistor; Manufacturer: GENERIC; Manufacturer1 Part Number: RN73C2A1K3BTG; Power: 0.1W; TC: ±10ppm; PressFit: No; Part Number: R0805_1K3_0.1%_0.1W_10PPM; Component Kind: Standard; Component Type: Standard; Pin Count: 2; Value: 1k3; Status: Not Recommended; Manufacturer Part Number: R0805_1K3_0.1%_0.1W_10PPM; Case: 0805; Mounted: Yes; Sense: No; Socket: No; SMD: Yes; Manufacturer1 Example: TYCO HOLSWORTHY; Manufacturer1 ComponentHeight: 0.6mm; HelpURL: \\cern.ch\dfs\Applications\Altium\Datasheets\R0805_Tyco_RN73.pdf; Author: CERN DEM JLC; CreateDate: 03.12.2007; LatestRevisionDate: 13.03.2008
R114 = R0402_330R_1%_0.0625W_100PPM: Resistor - 1%; Part Description: General Purpose Thick Film Chip Resistor; Manufacturer: GENERIC; Manufacturer1 Part Number: 232270673301L; TC: ±100ppm/°C; PressFit: No; Part Number: R0402_330R_1%_0.0625W_100PPM; Component Kind: Standard; Component Type: Standard; Pin Count: 2; Value: 330; Status: Not Recommended; Power: 0.0625W; Manufacturer Part Number: R0402_330R_1%_0.0625W_100PPM; Case: 0402; Mounted: Yes; Sense: No; Socket: No; SMD: Yes; Manufacturer1 Example: YAGEO PHYCOMP; Manufacturer1 ComponentHeight: 0.4mm; HelpURL: \\cern.ch\dfs\Applications\Altium\Datasheets\R0402_Phycomp_RC0402.pdf; Author: CERN DEM JLC; CreateDate: 03.12.2007; LatestRevisionDate: 17.10.2012
X15 = MOLEX_15-24-9067: Connector 6 Male; Part Description: Mini-Fit BMI Header, Dual Row, Right-Angle, with Snap-in Plastic Peg PCB Lock, 6 Circuits, Gold (Au) Plating; Manufacturer: MOLEX; PressFit: No; Part Number: MOLEX_15-24-9067; Component Kind: Standard; Component Type: Standard; Pin Count: 6; Family: Mini-Fit BMI; Mounted: Yes; Socket: No; SMD: No; Sense: No; Status: None; Manufacturer Part Number: 15-24-9067; ComponentHeight: 15mm; HelpURL: \\cern.ch\dfs\Applications\Altium\Datasheets\MOLEX_15-24-9067.pdf; Author: CERN DEM HF; CreateDate: 06.06.2024; LatestRevisionDate: 06.06.2024